# EAGLE schematic EEZ PSU consolidated r5B13a (EAGLE 6.1), part 1 of 2
Assembly variants: Farnell, TME

## Sheet 1 of 12: Power pre-regulator
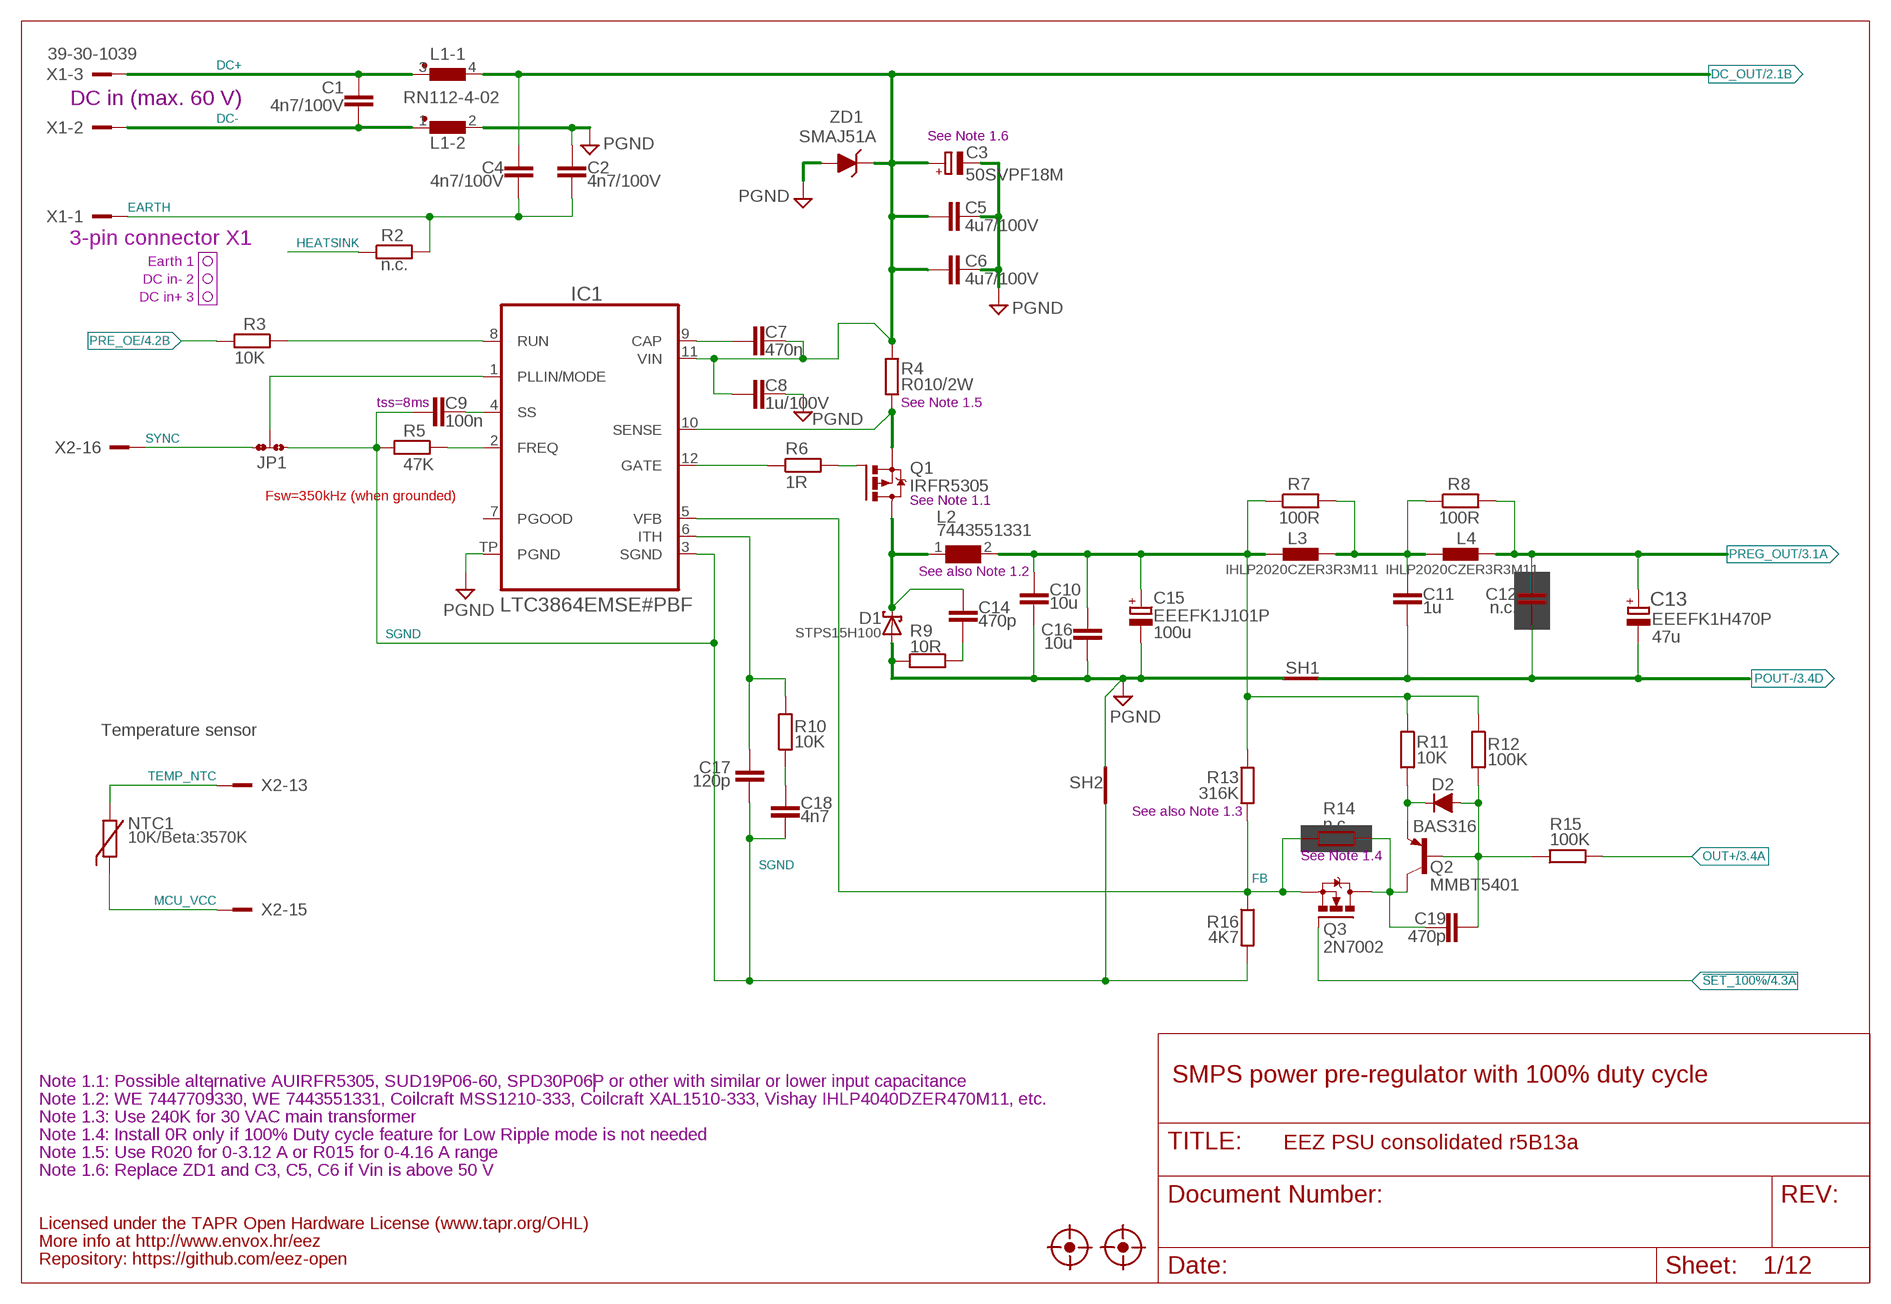
[diagram p0: schematic, sheet 1]

### Parts
C1  4n7/100V  C-EUC1206  [C1206]
C2  4n7/100V  C-EUC1206  [C1206]
C3  50SVPF18M  EEE-FK1J220P-CASE-E  [CAPAE830X650N]
C4  4n7/100V  C-EUC1206  [C1206]
C5  4u7/100V  C-EUC1210  [C1210]
C6  4u7/100V  C-EUC1210  [C1210]
C7  470n  C-EUC0805  [C0805]
C8  1u/100V  C-EUC1206  [C1206]
C9  100n  C-EUC0603  [C0603]
C10  10u  C-EUC1210  [C1210]
C11  1u  C-EUC0805  [C0805]
C12  n.c.  C-EUC0805  [C0805]
C13  EEEFK1H470P  EEE-FK1J470P-CASE-F  [CAPAE830X1050N]
C14  470p  C-EUC0805  [C0805]
C15  EEEFK1J101P  ECAPF  [PANASONIC_F]
C16  10u  C-EUC1210  [C1210]
C17  120p  C-EUC0805  [C0805]
C18  4n7  C-EUC0805  [C0805]
C19  470p  C-EUC0805  [C0805]
D1  STPS15H100  SCHOTTKYTO252  [TO252]
D2  BAS316  DIODESOD323R  [SOD323-R]
FM1  FIDUCIAL_2  [FIDUCIAL_DUAL]
FM2  FIDUCIAL_2  [FIDUCIAL_DUAL]
IC1  LTC3864EMSE#PBF  LTC3864  [LTC_05-08-1666]
JP1  JP3-CUT  [JP3-CUT]
L1  RN112-4-02  RN112  [RN112]
L2  7443551331  WE-HCI-7443551331_1350/1365  [WE-HCI_1350/1365]
L3  IHLP2020CZER3R3M11  IHLP-2020BZ-11  [IHLP-2020BZ-11]
L4  IHLP2020CZER3R3M11  IHLP-2020BZ-11  [IHLP-2020BZ-11]
NTC1  10K/Beta:3570K  NTC0805  [R_0204/5+0805]
Q1  IRFR5305  P-MOSFETDPAK  [TO229P990X239-3N]
Q2  MMBT5401  BC857B-PNP-SOT23-BEC  [SOT23-BEC]
Q3  2N7002  [SOT103P240X110-3N]
R2  n.c.  R-EU_R0805  [R0805]
R3  10K  R-EU_R0805  [R0805]
R4  R010/2W  R-EU_R2512  [R2512]
R5  47K  R-EU_R0805  [R0805]
R6  1R  R-EU_R0805  [R0805]
R7  100R  R-EU_R0805  [R0805]
R8  100R  R-EU_R0805  [R0805]
R9  10R  R-EU_R1206  [R1206]
R10  10K  R-EU_R0805  [R0805]
R11  10K  R-EU_R0805  [R0805]
R12  100K  R-EU_R0805  [R0805]
R13  316K  R-EU_R0805  [R0805]
R14  n.c.  R-EU_R0805  [R0805]
R15  100K  R-EU_R0805  [R0805]
R16  4K7  R-EU_R0805  [R0805]
SH1  Pgnd to Pout- short  SHORTNOHOLE  [SHORT_NOHOLE]
SH2  Sgnd to Pgnd short  SHORTNOHOLE  [SHORT_NOHOLE]
X1  39-30-1039  MINIFIT_39301039  [MINIFIT_39301039]
X2  SSW-113-02-T-D-RA  [SSW-113-02-T-D-RA]
ZD1  SMAJ51A  P6SMB68A  [DO214AA]

### Nets
!SET_100%: Q3.1(G) ; also sheet 4
DC+: C1.2 L1.3 X1.3
DC-: C1.1 L1.1 X1.2
DC_OUT: C3.1 C4.2 C5.1 C6.1 C7.2 C8.1 IC1.11(VIN) L1.4 R4.1 ZD1.C ; also sheet 2,3,12
EARTH: C2.2 C4.1 R2.2 X1.1 ; also sheet 8,10
FB: IC1.5(VFB) Q3.2(S) R13.2 R14.2 R16.1
GND [gnd]: C2.1 C3.2 C5.2 C6.2 C8.2 C10.2 C15.2(-) C16.2 D1.1(A) D1.2(A) IC1.TP(PGND) L1.2 R9.1 SH1.P$2(GND_B) SH2.P$2(GND_B) ZD1.A ; supply symbol labelled PGND ; also sheet 2,3,4,5,6,7,8,9,10,11,12
HEATSINK: R2.1
L_OUT: C10.1 C15.1(+) C16.1 L2.2 L3.1 R7.1 R11.1 R12.1 R13.1
MCU_VCC: NTC1.2 NTC1.2.1 X2.15
MODE: IC1.1(PLLIN/MODE) JP1.COM
N$15: Q1.1(G) R6.2
N$19: D2.C Q2.E R11.2
N$20: C17.1 IC1.6(ITH) R10.2
N$21: C18.1 R10.1
N$23: C7.1 IC1.9(CAP)
N$30: IC1.12(GATE) R6.1
N$31: IC1.2(FREQ) R5.1
N$33: C9.2 IC1.4(SS)
N$34: C19.1 Q2.C Q3.3(D) R14.1
N$35: C11.1 L3.2 L4.1 R7.2 R8.1
N$36: IC1.8(RUN) R3.1
N$38: C14.2 R9.2
N$79: C19.2 D2.A Q2.B R12.2 R15.1
OUT+: R15.2 ; also sheet 3,5
POUT-: C11.2 C12.2 C13.2 SH1.P$1(GND_A) ; also sheet 3
PRE_OE: R3.2 ; also sheet 4
PREG_OUT: C12.1 C13.1 L4.2 R8.2 ; also sheet 3
SENSE: IC1.10(SENSE) Q1.3(S) R4.2
SGND: C9.1 C17.2 C18.2 IC1.3(SGND) JP1.NO R5.2 R16.2 SH2.P$1(GND_A)
SW: C14.1 D1.3(C) L2.1 Q1.2(D)
SYNC: JP1.NC X2.16
TEMP_NTC: NTC1.1 NTC1.1.1 X2.13
Unconnected: IC1.7(PGOOD)

### Notes on the sheet
- DC in (max. 60 V)
- See Note 1.6
- 3-pin connector X1
- Earth 1
- DC in- 2
- DC in+ 3
- tss=8ms | See Note 1.5
- Fsw=350kHz (when grounded)
- See Note 1.1
- See also Note 1.2
- 100u | 47u
- Temperature sensor
- See also Note 1.3
- See Note 1.4
- Note 1.1: Possible alternative AUIRFR5305, SUD19P06-60, SPD30P06P or other with similar or lower input capacitance | SMPS power pre-regulator with 100% duty cycle
- Note 1.2: WE 7447709330, WE 7443551331, Coilcraft MSS1210-333, Coilcraft XAL1510-333, Vishay IHLP4040DZER470M11, etc.
- Note 1.3: Use 240K for 30 VAC main transformer
- Note 1.4: Install 0R only if 100% Duty cycle feature for Low Ripple mode is not needed
- Note 1.5: Use R020 for 0-3.12 A or R015 for 0-4.16 A range
- Note 1.6: Replace ZD1 and C3, C5, C6 if Vin is above 50 V
- Licensed under the TAPR Open Hardware License (www.tapr.org/OHL)
- More info at http://www.envox.hr/eez
- Repository: https://github.com/eez-open

## Sheet 2 of 12: Bias power
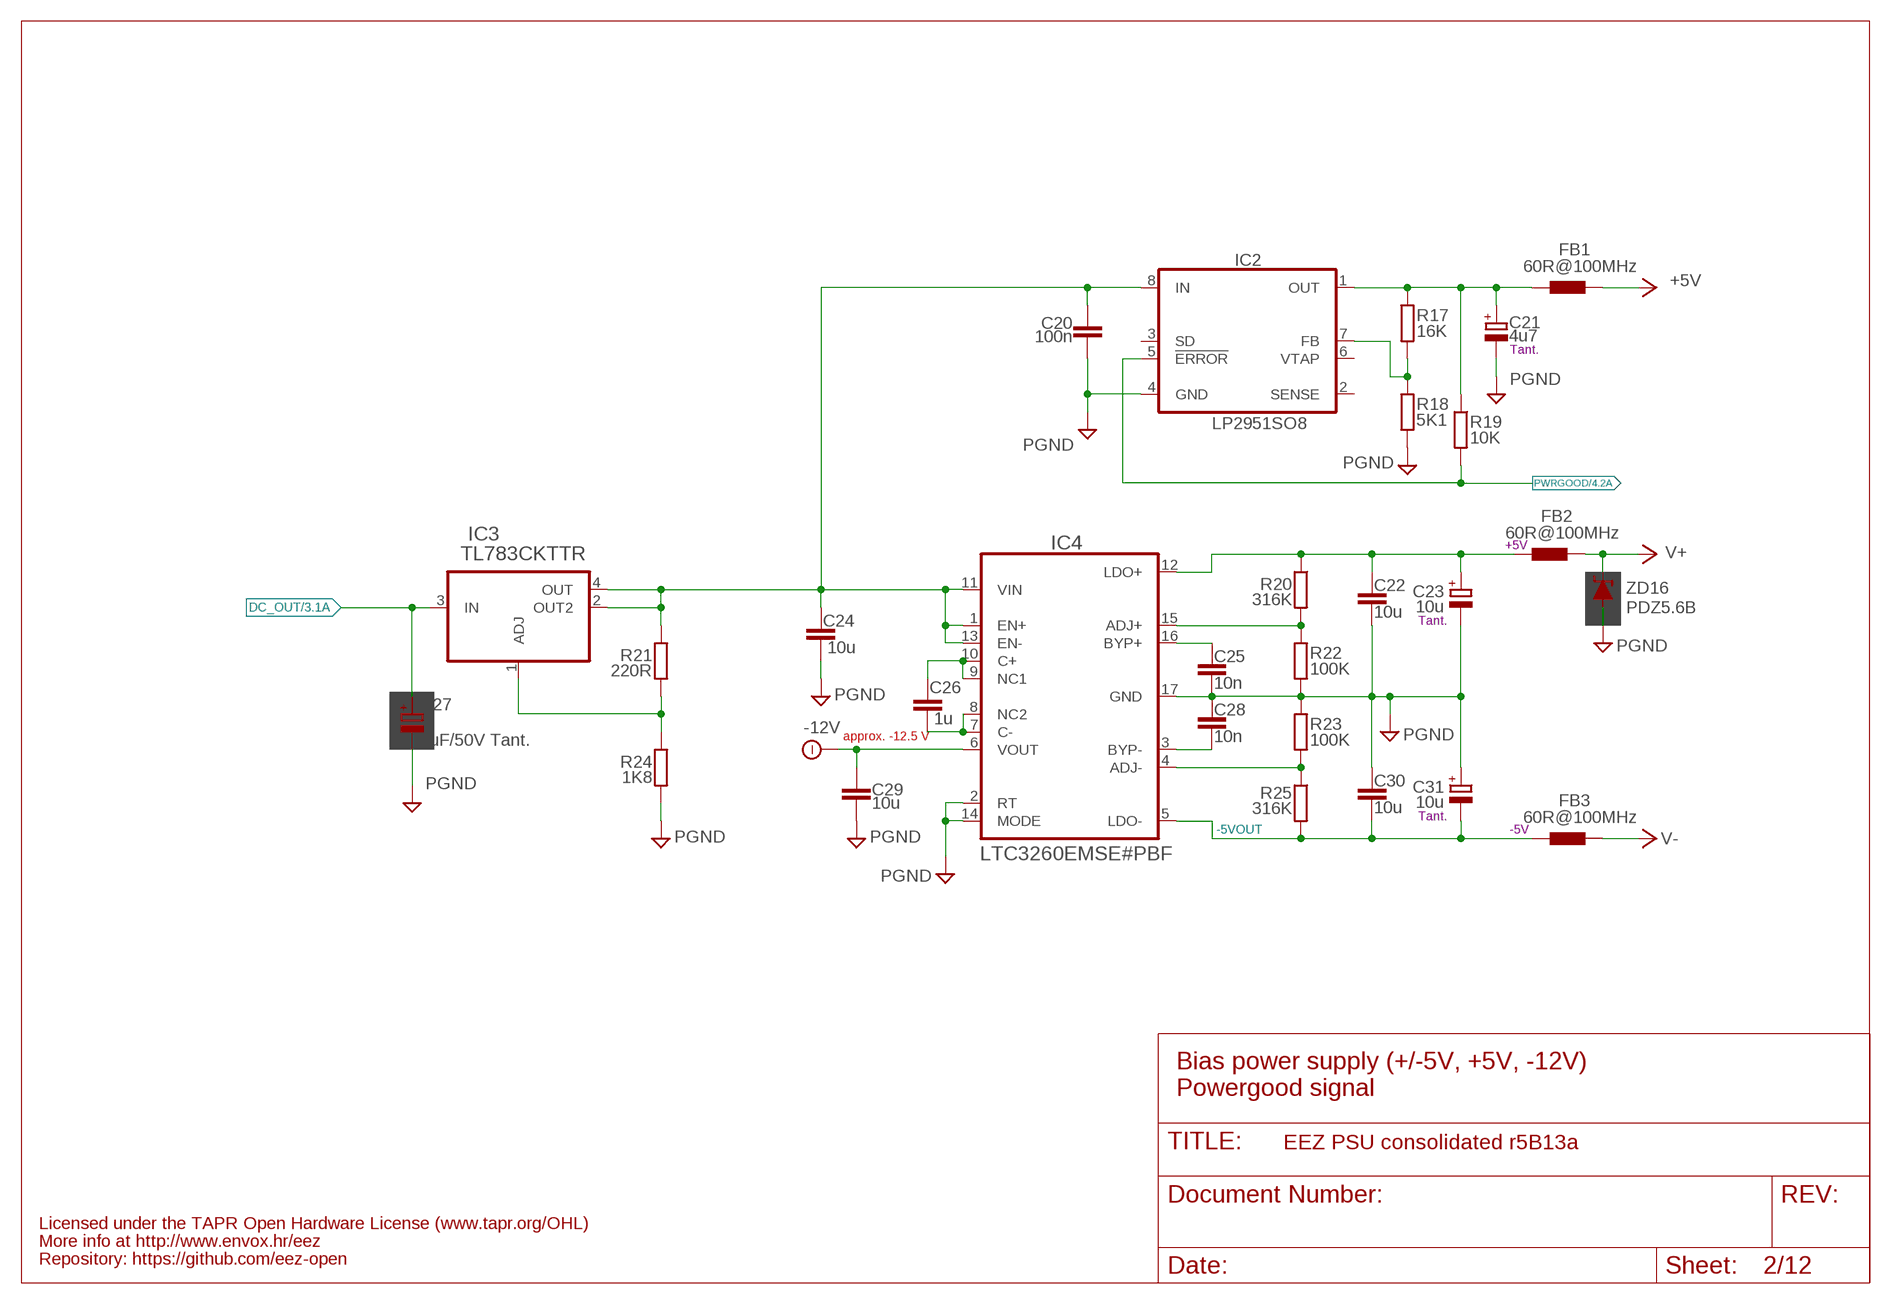
[diagram p1: schematic, sheet 2]

### Parts
C20  100n  C-EUC0603  [C0603]
C21  4u7  ECAP1206  [EC1206]
C22  10u  C-EUC1210  [C1210]  (variant Farnell: 2320829)  (variant TME: CL21B225KAFNNNG )
C23  10u  ECAP1206  [EC1206]
C24  10u  C-EUC1210  [C1210]
C25  10n  C-EUC0805  [C0805]
C26  1u  C-EUC0805  [C0805]
C27  1uF/50V Tant.  CPOL-EUC/6032-28R  [C/6032-28R]
C28  10n  C-EUC0805  [C0805]
C29  10u  C-EUC1210  [C1210]
C30  10u  C-EUC1210  [C1210]
C31  10u  ECAP1206  [EC1206]
FB1  60R@100MHz  FERRITE_BEAD0603  [BEAD0603]
FB2  60R@100MHz  FERRITE_BEAD0603  [BEAD0603]
FB3  60R@100MHz  FERRITE_BEAD0603  [BEAD0603]
IC2  LP2951SO8  [SOIC127P600X175-8N]
IC3  TL783CKTTR  [TO254P1524X483-4N]
IC4  LTC3260EMSE#PBF  LTC3260MSOP16  [SOP50P490X110-17N]
R17  16K  R-EU_R0805  [R0805]
R18  5K1  R-EU_R0805  [R0805]
R19  10K  R-EU_R0805  [R0805]
R20  316K  R-EU_R0805  [R0805]
R21  220R  R-EU_R0805  [R0805]
R22  100K  R-EU_R0805  [R0805]
R23  100K  R-EU_R0805  [R0805]
R24  1K8  R-EU_R0805  [R0805]
R25  316K  R-EU_R0805  [R0805]
ZD16  PDZ5.6B  ZENER-DIODESOD323  [SOD323-W]

### Nets
+5V: FB1.P$2 ; also sheet 3,4,5,6,7,8,9,10,11
+VNR: C20.1 C24.1 IC2.8(IN) IC3.2(OUT2) IC3.4(OUT) IC4.1(EN+) IC4.11(VIN) IC4.13(EN-) R21.1
-5VOUT: C30.2 C31.- FB3.P$1 IC4.5(LDO-) R25.2
-12V: C29.1 IC4.6(VOUT) ; also sheet 3
DC_OUT: C27.+ IC3.3(IN) ; also sheet 1,3,12
GND [gnd]: C20.2 C21.- C22.2 C23.- C24.2 C25.1 C27.- C28.1 C29.2 C30.1 C31.+ IC2.4(GND) IC4.2(RT) IC4.14(MODE) IC4.17(GND) R18.2 R22.2 R23.1 R24.2 ZD16.A ; supply symbol labelled PGND ; also sheet 1,3,4,5,6,7,8,9,10,11,12
N$5: C22.1 C23.+ FB2.P$1 IC4.12(LDO+) R20.1
N$6: C26.1 IC4.9(NC1) IC4.10(C+)
N$7: IC3.1(ADJ) R21.2 R24.1
N$14: IC4.15(ADJ+) R20.2 R22.1
N$43: C26.2 IC4.7(C-) IC4.8(NC2)
N$52: C25.2 IC4.16(BYP+)
N$57: IC4.4(ADJ-) R23.2 R25.1
N$58: C28.2 IC4.3(BYP-)
N$63: IC2.7(FB) R17.2 R18.1
N$167: C21.+ FB1.P$1 IC2.1(OUT) R17.1 R19.1
PWRGOOD: IC2.5(!ERROR) R19.2 ; also sheet 4
V+: FB2.P$2 ZD16.C ; also sheet 3,4,5
V-: FB3.P$2 ; also sheet 3,5
Unconnected: IC2.2(SENSE) IC2.3(SD) IC2.6(VTAP)

### Notes on the sheet
- Tant.
- +5V
- Tant.
- approx. -12.5 V
- Tant.
- -5V
- Bias power supply (+/-5V, +5V, -12V)
- Powergood signal
- Licensed under the TAPR Open Hardware License (www.tapr.org/OHL)
- More info at http://www.envox.hr/eez
- Repository: https://github.com/eez-open

## Sheet 3 of 12: Post-regulator
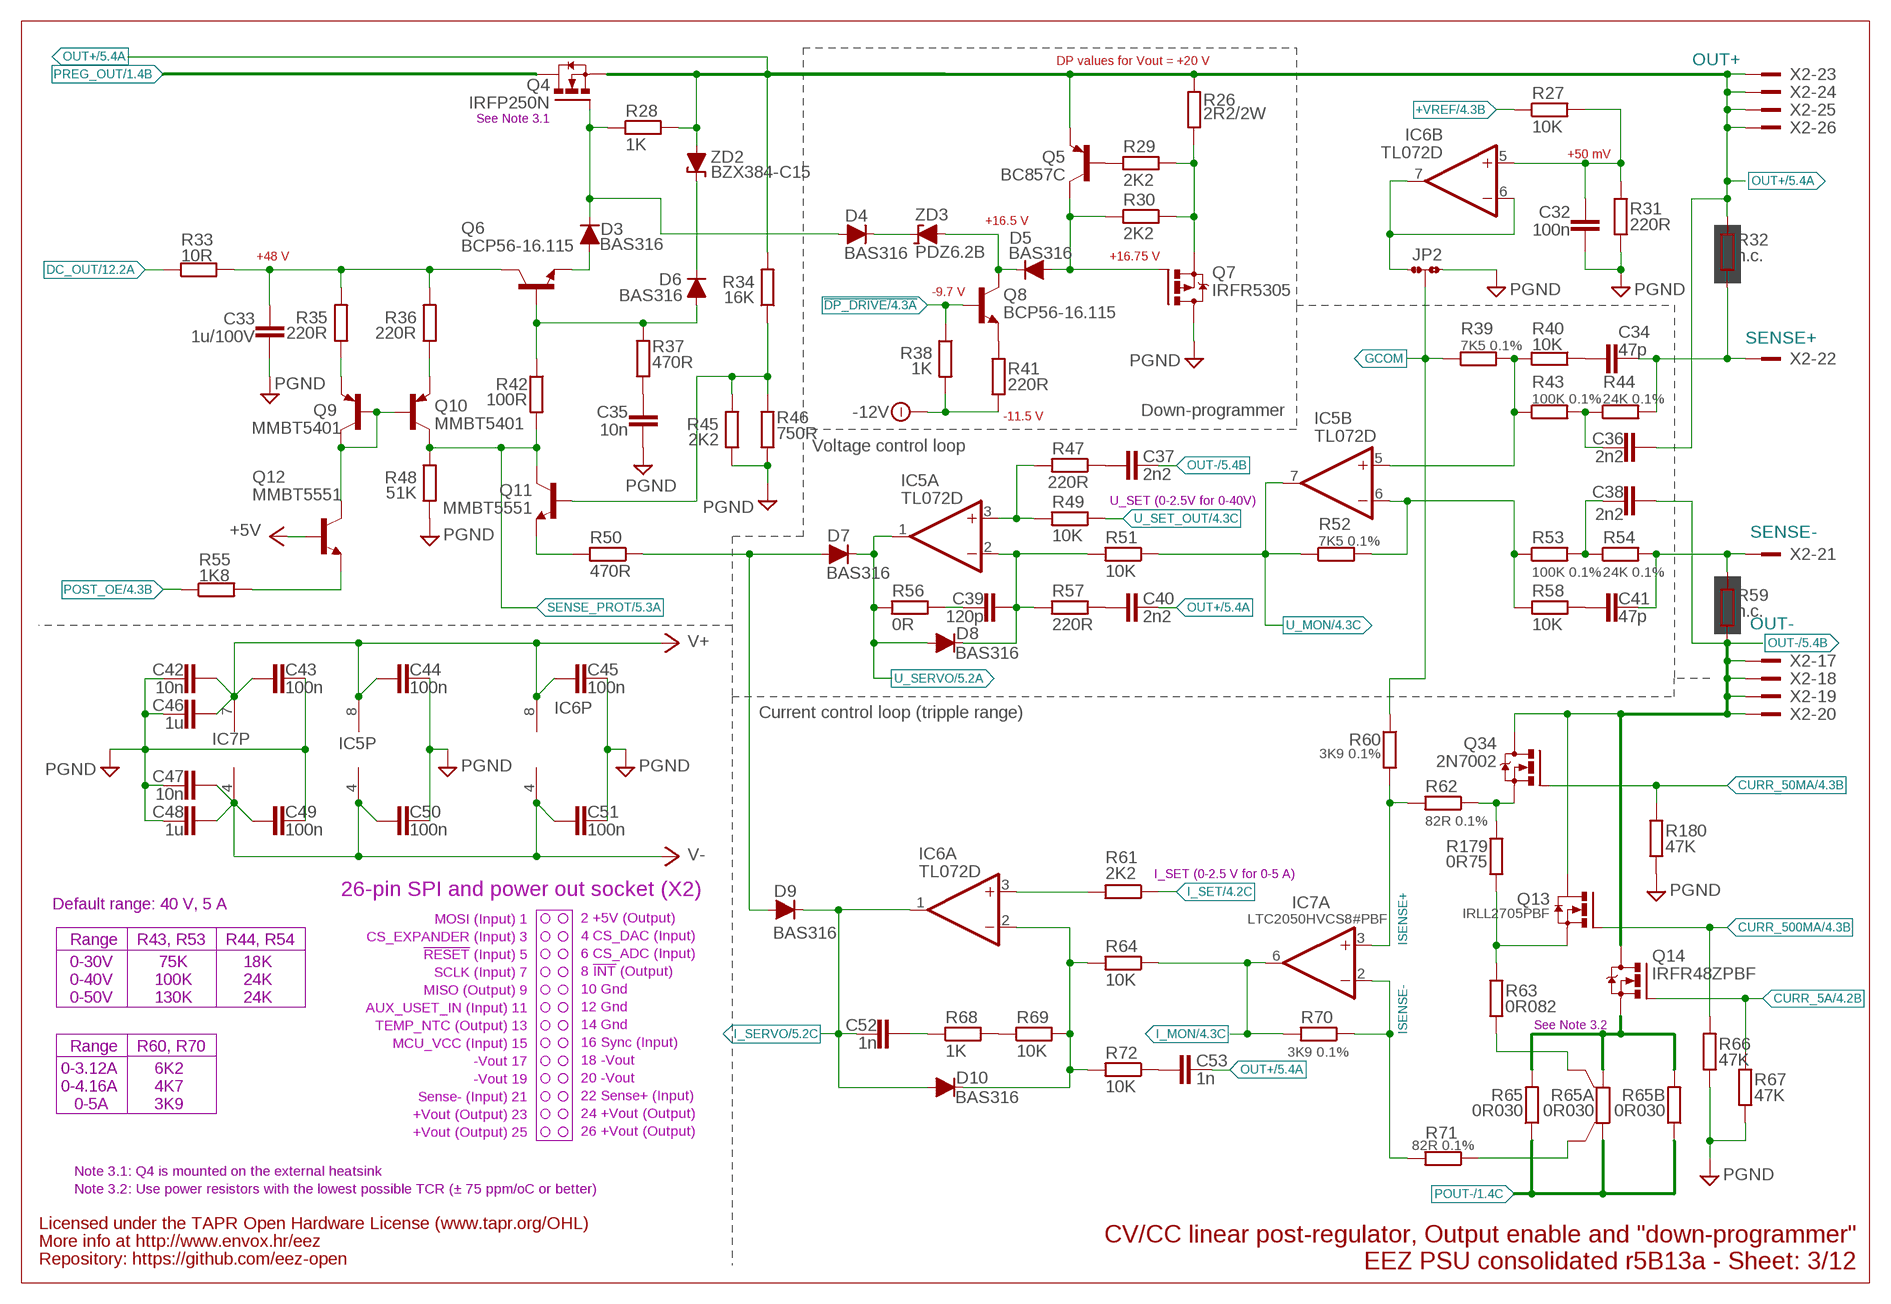
[diagram p2: schematic, sheet 3]

### Parts
C32  100n  C-EUC0603  [C0603]
C33  1u/100V  C-EUC1206  [C1206]
C34  47p  C-EUC0805  [C0805]
C35  10n  C-EUC0805  [C0805]
C36  2n2  C-EUC0805  [C0805]
C37  2n2  C-EUC0805  [C0805]
C38  2n2  C-EUC0805  [C0805]
C39  120p  C-EUC0805  [C0805]
C40  2n2  C-EUC0805  [C0805]
C41  47p  C-EUC0805  [C0805]
C42  10n  C-EUC0805  [C0805]
C43  100n  C-EUC0603  [C0603]
C44  100n  C-EUC0603  [C0603]
C45  100n  C-EUC0603  [C0603]
C46  1u  C-EUC0805  [C0805]
C47  10n  C-EUC0805  [C0805]
C48  1u  C-EUC0805  [C0805]
C49  100n  C-EUC0603  [C0603]
C50  100n  C-EUC0603  [C0603]
C51  100n  C-EUC0603  [C0603]
C52  1n  C-EUC0805  [C0805]
C53  1n  C-EUC0805  [C0805]
D3  BAS316  DIODESOD323R  [SOD323-R]
D4  BAS316  DIODESOD323R  [SOD323-R]
D5  BAS316  DIODESOD323R  [SOD323-R]
D6  BAS316  DIODESOD323R  [SOD323-R]
D7  BAS316  DIODESOD323R  [SOD323-R]
D8  BAS316  DIODESOD323R  [SOD323-R]
D9  BAS316  DIODESOD323R  [SOD323-R]
D10  BAS316  DIODESOD323R  [SOD323-R]
IC5  TL072D  TL072SOIC8  [SOIC127P600X173-8N]
IC6  TL072D  TL072SOIC8  [SOIC127P600X173-8N]
IC7  LTC2050HVCS8#PBF  OP27GSZSO8  [SOIC127P600X173-8N]
JP2  JP3-CUT  [JP3-CUT]
Q4  IRFP250N  IRFP240BOTTOM  [TO247BH-CLR]
Q5  BC857C  BC857C-PNP-SOT23-BEC  [SOT23-BEC]
Q6  BCP56-16.115  BCP56  [SOT230P700X180-4N]
Q7  IRFR5305  P-MOSFETDPAK  [TO229P990X239-3N]
Q8  BCP56-16.115  BCP56  [SOT230P700X180-4N]
Q9  MMBT5401  BC857B-PNP-SOT23-BEC  [SOT23-BEC]
Q10  MMBT5401  BC857B-PNP-SOT23-BEC  [SOT23-BEC]
Q11  MMBT5551  MMBT5551LT1-NPN-SOT23-BEC  [SOT23-BEC]
Q12  MMBT5551  MMBT5551LT1-NPN-SOT23-BEC  [SOT23-BEC]
Q13  IRLL2705PBF  N-HEXFET-2D_SOT232-IRLL014N  [SOT223]
Q14  IRFR48ZPBF  N-MOSFETDPAK  [TO229P990X239-3N]
Q34  2N7002  [SOT103P240X110-3N]
R26  2R2/2W  R-EU_R2512  [R2512]
R27  10K  R-EU_R0805  [R0805]
R28  1K  R-EU_R0805  [R0805]
R29  2K2  R-EU_R0805  [R0805]
R30  2K2  R-EU_R0805  [R0805]
R31  220R  R-EU_R0805  [R0805]
R32  n.c.  R-EU_R0805  [R0805]
R33  10R  R-EU_R1206  [R1206]
R34  16K  R-EU_R0805  [R0805]
R35  220R  R-EU_R0805  [R0805]
R36  220R  R-EU_R0805  [R0805]
R37  470R  R-EU_R0805  [R0805]
R38  1K  R-EU_R0805  [R0805]
R39  7K5 0.1%  R-EU_R0805  [R0805]
R40  10K  R-EU_R0805  [R0805]
R41  220R  R-EU_R0805  [R0805]
R42  100R  R-EU_R0805  [R0805]
R43  100K 0.1%  R-EU_R0805  [R0805]
R44  24K 0.1%  R-EU_R0805  [R0805]
R45  2K2  R-EU_R0805  [R0805]
R46  750R  R-EU_R0805  [R0805]
R47  220R  R-EU_R0805  [R0805]
R48  51K  R-EU_R0805  [R0805]
R49  10K  R-EU_R0805  [R0805]
R50  470R  R-EU_R0805  [R0805]
R51  10K  R-EU_R0805  [R0805]
R52  7K5 0.1%  R-EU_R0805  [R0805]
R53  100K 0.1%  R-EU_R0805  [R0805]
R54  24K 0.1%  R-EU_R0805  [R0805]
R55  1K8  R-EU_R0805  [R0805]
R56  0R  R-EU_R0805  [R0805]
R57  220R  R-EU_R0805  [R0805]
R58  10K  R-EU_R0805  [R0805]
R59  n.c.  R-EU_R0805  [R0805]
R60  3K9 0.1%  R-EU_R0805  [R0805]
R61  2K2  R-EU_R0805  [R0805]
R62  82R 0.1%  R-EU_R0805  [R0805]
R63  0R082  R-EU_R1210  [R1210]
R64  10K  R-EU_R0805  [R0805]
R65  0R030  R-EU_R2512  [R2512]
R65A  0R030  R-EU_4WIRE2512  [R_2512-4WIRE]
R65B  0R030  R-EU_R2512  [R2512]
R66  47K  R-EU_R0805  [R0805]
R67  47K  R-EU_R0805  [R0805]
R68  1K  R-EU_R0805  [R0805]
R69  10K  R-EU_R0805  [R0805]
R70  3K9 0.1%  R-EU_R0805  [R0805]
R71  82R 0.1%  R-EU_R0805  [R0805]
R72  10K  R-EU_R0805  [R0805]
R179  0R75  R-EU_R1206  [R1206]
R180  47K  R-EU_R0805  [R0805]
ZD2  BZX384-C15  ZENER-DIODESOD323  [SOD323-W]
ZD3  PDZ6.2B  ZENER-DIODESOD323  [SOD323-W]

### Nets
!DP_DRIVE: Q8.1(B) R38.1 ; also sheet 4
+5V: Q12.B ; also sheet 2,4,5,6,7,8,9,10,11
+VREF: R27.1 ; also sheet 4
-12V: R38.2 R41.2 ; also sheet 2
CURR_5A: Q14.1(G) R67.2 ; also sheet 4
CURR_50MA: Q34.1(G) R180.2 ; also sheet 4
CURR_500MA: Q13.1(G) R66.2 ; also sheet 4
DC_BIAS: C33.1 Q6.2(C) Q6.4(C) R33.2 R35.2 R36.2
DC_OUT: R33.1 ; also sheet 1,2,12
GCOM [gnd]: JP2.COM R39.1 R60.1
GND [gnd]: C32.2 C33.2 C35.2 C42.1 C43.2 C44.1 C45.1 C46.1 C47.1 C48.1 C49.2 C50.1 C51.1 JP2.NO Q7.2(D) R31.2 R45.1 R46.1 R48.1 R66.1 R67.1 R180.1 ; supply symbol labelled PGND ; also sheet 1,2,4,5,6,7,8,9,10,11,12
I_MON: IC7.6(A:OUT) R64.1 R70.2 ; also sheet 4
I_SERVO: C52.2 D9.C D10.A IC6.1(A:OUT) ; also sheet 5
I_SET: R61.1 ; also sheet 4
ISENSE+: IC7.3(A:+IN) R60.2 R62.2
ISENSE-: IC7.2(A:-IN) R70.1 R71.2
LOOP_CTRL: D7.A D9.A R50.1
N$1: Q8.3(E) R41.1
N$2: Q5.B R29.2
N$3: C34.2 R40.1
N$10: C41.2 R58.1
N$13: C32.1 IC6.5(B:+IN) R27.2 R31.1
N$16: IC6.6(B:-IN) IC6.7(B:OUT) JP2.NC
N$17: C38.1 R53.2 R54.1
N$18: C39.2 R56.1
N$22: C53.2 R72.1
N$26: C37.2 R47.1
N$27: C40.2 R57.1
N$29: IC5.3(A:+IN) R47.2 R49.2
N$32: C39.1 D8.C IC5.2(A:-IN) R51.2 R57.2
N$37: D10.C IC6.2(A:-IN) R64.2 R69.2 R72.2
N$44: Q11.B R34.1 R45.2 R46.2
N$50: IC6.3(A:+IN) R61.2
N$56: D3.C D4.A Q4.G R28.1
N$60: Q34.2(S) R62.1 R179.1
N$62: D3.A Q6.3(E)
N$65: D6.A Q6.1(B) R37.2 R42.1
N$67: C35.1 R37.1
N$70: R63.1 R65A.2S
N$117: C36.1 R43.2 R44.1
N$129: D6.C ZD2.C
N$143: D4.C ZD3.C
N$145: Q11.E R50.2
N$146: Q7.3(S) R26.1 R29.1 R30.1
N$147: D5.A Q5.C Q7.1(G) R30.2
N$150: IC5.5(B:+IN) R39.2 R40.2 R43.1
N$158: IC5.6(B:-IN) R52.2 R53.1 R58.2
N$160: R68.2 R69.1
N$162: C52.1 R68.1
N$169: Q14.3(S) R65.2 R65A.2 R65B.2
N$183: Q10.E R36.1
N$184: Q9.E R35.1
N$186: Q12.E R55.2
N$200: R65A.1S R71.1
N$201: Q13.3(S) R63.2 R179.2
OUT+: C36.2 C40.1 C53.1 Q4.S Q5.E R26.2 R28.2 R32.1 R34.2 X2.23 X2.24 X2.25 X2.26 ZD2.A ; also sheet 1,5
OUT-: C37.1 C38.2 Q13.2(D) Q13.4(D) Q14.2(D) Q34.3(D) R59.2 X2.17 X2.18 X2.19 X2.20 ; also sheet 5
POST_OE: R55.1 ; also sheet 4
POUT-: R65.1 R65A.1 R65B.1 ; also sheet 1
PREG_OUT: Q4.D ; also sheet 1
Q7C: Q9.B Q9.C Q10.B Q12.C
Q9C: D5.C Q8.2(C) Q8.4(C) ZD3.A
SENSE+: C34.1 R32.2 R44.2 X2.22 ; also sheet 5
SENSE-: C41.1 R54.2 R59.1 X2.21 ; also sheet 5
SENSE_PROT: Q10.C Q11.C R42.2 R48.2 ; also sheet 5
U_MON: IC5.7(B:OUT) R51.1 R52.1 ; also sheet 4
U_SERVO: D7.C D8.A IC5.1(A:OUT) R56.2 ; also sheet 5
U_SET_OUT: R49.1 ; also sheet 4
V+: C42.2 C43.1 C44.2 C45.2 C46.2 IC5.8(P:V+) IC6.8(P:V+) IC7.7(P:V+) ; also sheet 2,4,5
V-: C47.2 C48.2 C49.1 C50.2 C51.2 IC5.4(P:V-) IC6.4(P:V-) IC7.4(P:V-) ; also sheet 2,5

### Notes on the sheet
- DP values for Vout = +20 V
- See Note 3.1
- +50 mV
- +16.5 V
- +48 V | +16.75 V
- -9.7 V
- Down-programmer
- -11.5 V
- Voltage control loop
- U_SET (0-2.5V for 0-40V)
- Current control loop (tripple range)
- I_SET (0-2.5 V for 0-5 A)
- 26-pin SPI and power out socket (X2)
- Default range: 40 V, 5 A
- MOSI (Input) 1
- 2 +5V (Output)
- CS_EXPANDER (Input) 3
- 4 CS_DAC (Input)
- Range | R43, R53 | R44, R54
- !RESET! (Input) 5
- 6 CS_ADC (Input)
- 0-30V | 75K | 18K | SCLK (Input) 7
- 8 !INT! (Output)
- 0-40V | 100K | 24K | MISO (Output) 9
- 10 Gnd
- 0-50V | 130K | 24K | AUX_USET_IN (Input) 11
- 12 Gnd
- TEMP_NTC (Output) 13 | See Note 3.2
- 14 Gnd
- MCU_VCC (Input) 15
- 16 Sync (Input)
- Range | R60, R70
- -Vout 17
- 18 -Vout
- 0-3.12A | 6K2 | -Vout 19
- 20 -Vout
- 0-4.16A | 4K7 | Sense- (Input) 21
- 22 Sense+ (Input)
- 0-5A | 3K9 | +Vout (Output) 23
- 24 +Vout (Output)
- +Vout (Output) 25
- 26 +Vout (Output)
- Note 3.1: Q4 is mounted on the external heatsink
- Note 3.2: Use power resistors with the lowest possible TCR (± 75 ppm/oC or better)
- Licensed under the TAPR Open Hardware License (www.tapr.org/OHL)
- More info at http://www.envox.hr/eez | CV/CC linear post-regulator, Output enable and "down-programmer"
- Repository: https://github.com/eez-open | EEZ PSU consolidated r5B13a - Sheet: 3/12

## Sheet 4 of 12: Digital control, voltage reference
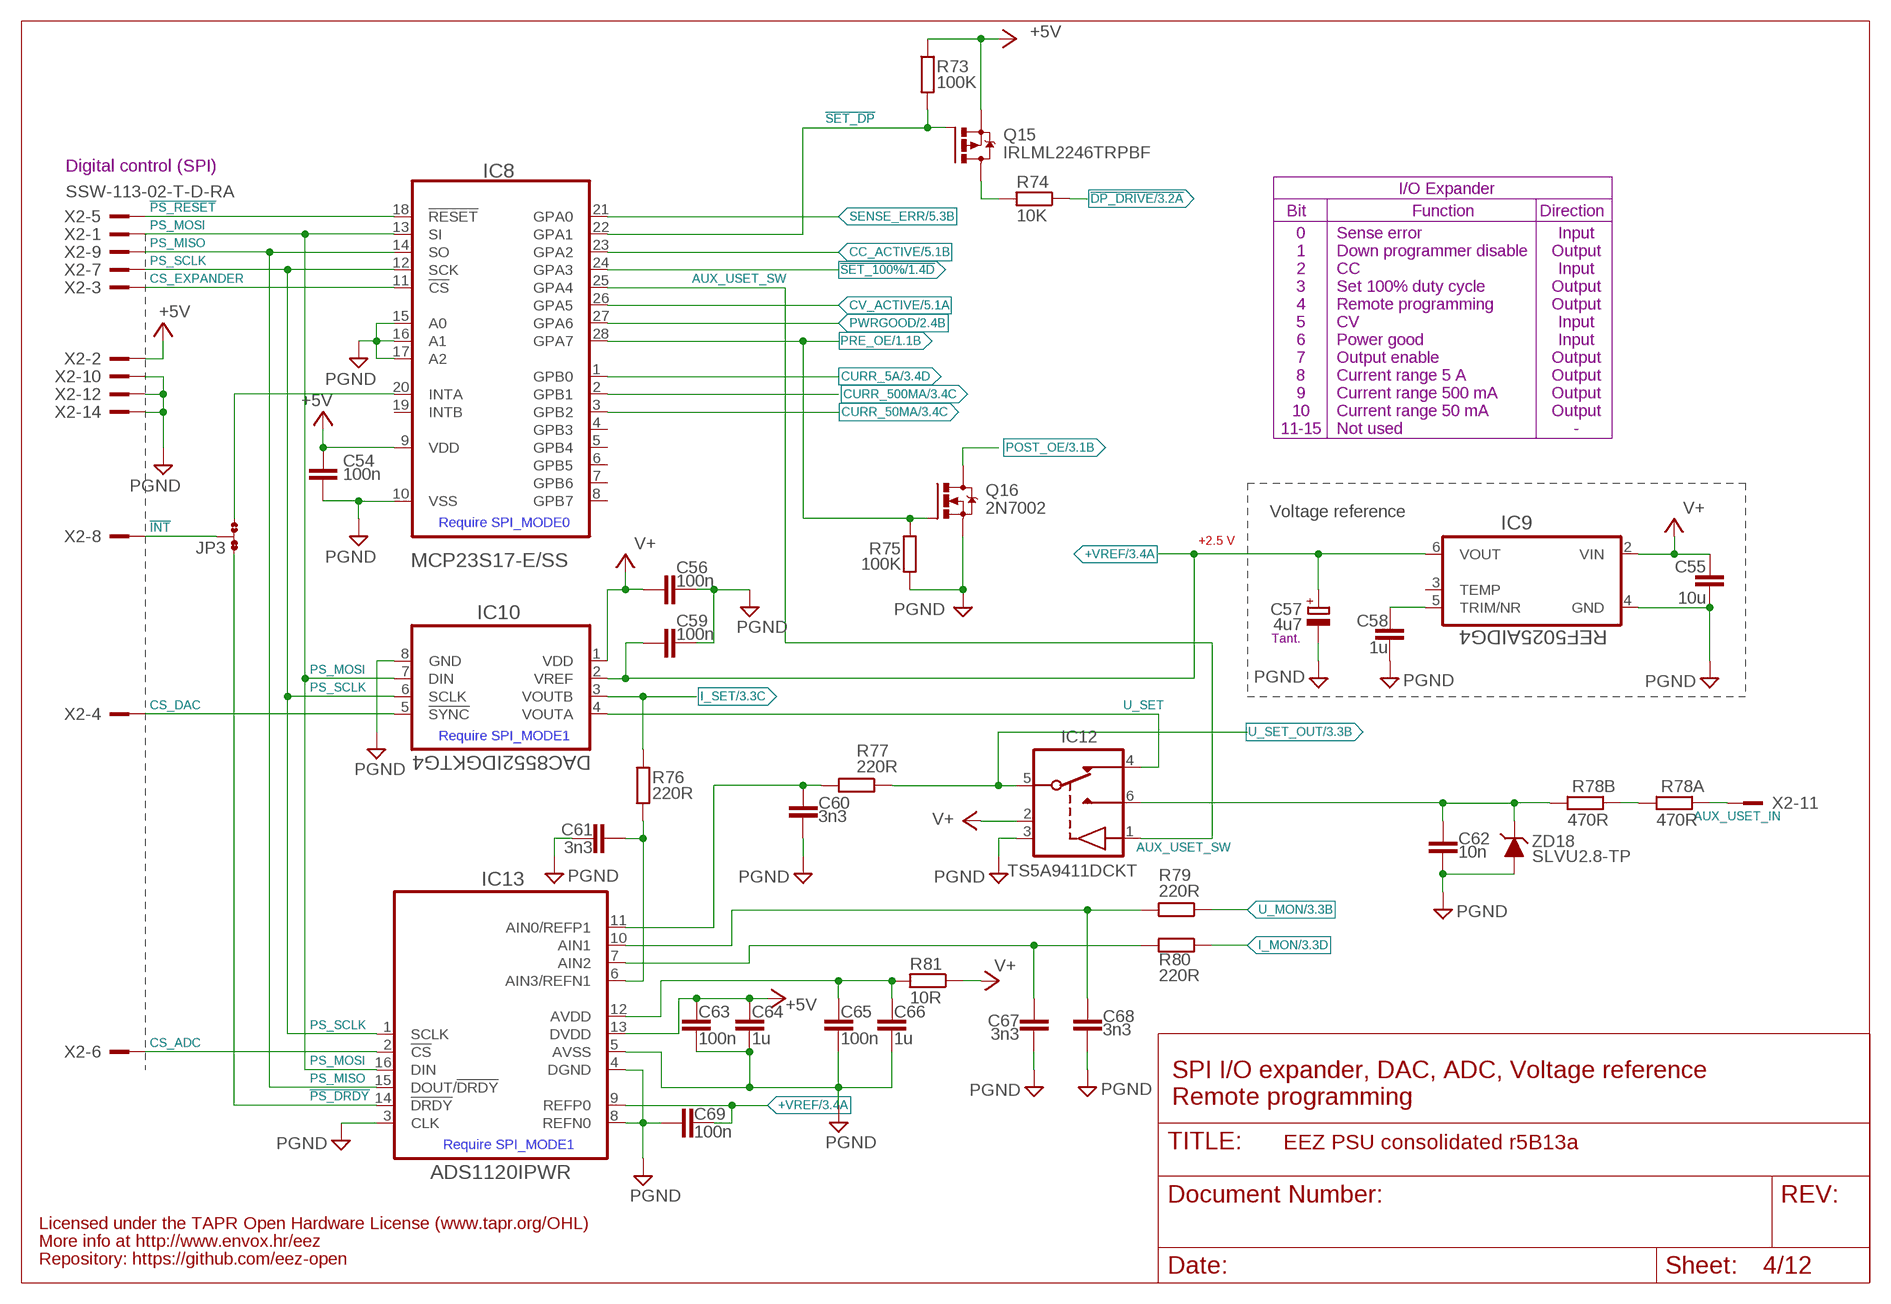
[diagram p3: schematic, sheet 4]

### Parts
C54  100n  C-EUC0603  [C0603]
C55  10u  C-EUC1210  [C1210]
C56  100n  C-EUC0603  [C0603]
C57  4u7  ECAP1206  [EC1206]
C58  1u  C-EUC0805  [C0805]
C59  100n  C-EUC0603  [C0603]
C60  3n3  C-EUC0805  [C0805]
C61  3n3  C-EUC0805  [C0805]
C62  10n  C-EUC0805  [C0805]
C63  100n  C-EUC0603  [C0603]
C64  1u  C-EUC0805  [C0805]
C65  100n  C-EUC0603  [C0603]
C66  1u  C-EUC0805  [C0805]
C67  3n3  C-EUC0805  [C0805]
C68  3n3  C-EUC0805  [C0805]
C69  100n  C-EUC0603  [C0603]
IC8  MCP23S17-E/SS  MCP23S17-E/SSSSOP  [SOP65P780X200-28N]
IC9  REF5025AIDG4  REF50XX  [SOIC127P600X175-8N]
IC10  DAC8552IDGKTG4  DAC8552_DGK_8M  [DGK8-M]
IC12  TS5A9411DCKT  [SOT65P210X110-6N]
IC13  ADS1120IPWR  ADS1120TSSOP-16  [PW(R-PDSO-G16)]
JP3  JP3-CUT  [JP3-CUT]
Q15  IRLML2246TRPBF  [SOT95P237X112-3N]
Q16  2N7002  [SOT103P240X110-3N]
R73  100K  R-EU_R0805  [R0805]
R74  10K  R-EU_R0805  [R0805]
R75  100K  R-EU_R0805  [R0805]
R76  220R  R-EU_R0805  [R0805]
R77  220R  R-EU_R0805  [R0805]
R78A  470R  R-EU_R0805  [R0805]
R78B  470R  R-EU_R0805  [R0805]
R79  220R  R-EU_R0805  [R0805]
R80  220R  R-EU_R0805  [R0805]
R81  10R  R-EU_R1206  [R1206]
ZD18  SLVU2.8-TP  SLVU2.8  [SOT23]

### Nets
!DP_DRIVE: R74.1 ; also sheet 3
!INT: JP3.COM X2.8
!PS_DRDY: IC13.14(!DRDY) JP3.NC
!PS_RESET: IC8.18(!RESET) X2.5
!SET_100%: IC8.24(GPA3) ; also sheet 1
!SET_DP: IC8.22(GPA1) Q15.1(G) R73.2
+5V: C54.1 C63.2 C64.2 IC8.9(VDD) IC13.13(DVDD) Q15.2(S) R73.1 X2.2 ; also sheet 2,3,5,6,7,8,9,10,11
+VREF: C57.+ C59.2 C69.2 IC9.6(VOUT) IC10.2(VREF) IC13.9(REFP0) ; also sheet 3
AUX_USET_IN: R78A.2 X2.11
AUX_USET_SW: IC8.25(GPA4) IC12.1(IN)
CC_ACTIVE: IC8.23(GPA2) ; also sheet 5
CS_ADC: IC13.2(!CS) X2.6
CS_DAC: IC10.5(!SYNC) X2.4
CS_EXPANDER: IC8.11(!CS) X2.3
CURR_5A: IC8.1(GPB0) ; also sheet 3
CURR_50MA: IC8.3(GPB2) ; also sheet 3
CURR_500MA: IC8.2(GPB1) ; also sheet 3
CV_ACTIVE: IC8.26(GPA5) ; also sheet 5
DP_LED: Q15.3(D) R74.2
GND [gnd]: C54.2 C55.2 C56.1 C57.- C58.2 C59.1 C60.1 C61.2 C62.1 C63.1 C64.1 C65.1 C66.1 C67.1 C68.1 C69.1 IC8.10(VSS) IC8.15(A0) IC8.16(A1) IC8.17(A2) IC9.4(GND) IC10.8(GND) IC12.3(GND) IC13.3(CLK) IC13.4(DGND) IC13.5(AVSS) IC13.8(REFN0) Q16.2(S) R75.1 X2.10 X2.12 X2.14 ZD18.1(A) ZD18.2(A) ; supply symbol labelled PGND ; also sheet 1,2,3,5,6,7,8,9,10,11,12
I_MON: R80.1 ; also sheet 3
I_SET: IC10.3(VOUTB) R76.1 ; also sheet 3
INT_EXP: IC8.20(INTA) JP3.NO
N$11: C58.1 IC9.5(TRIM/NR)
N$12: C62.2 IC12.6(S1) R78B.1 ZD18.3(C)
N$28: C68.2 IC13.10(AIN1) R79.2
N$41: C60.2 IC13.11(AIN0/REFP1) R77.2
N$42: C65.2 C66.2 IC13.12(AVDD) R81.2
N$51: C61.1 IC13.6(AIN3/REFN1) R76.2
N$55: C67.2 IC13.7(AIN2) R80.2
N$104: R78A.1 R78B.2
POST_OE: Q16.3(D) ; also sheet 3
PRE_OE: IC8.28(GPA7) Q16.1(G) R75.2 ; also sheet 1
PS_MISO: IC8.14(SO) IC13.15(DOUT/!DRDY) X2.9
PS_MOSI: IC8.13(SI) IC10.7(DIN) IC13.16(DIN) X2.1
PS_SCLK: IC8.12(SCK) IC10.6(SCLK) IC13.1(SCLK) X2.7
PWRGOOD: IC8.27(GPA6) ; also sheet 2
SENSE_ERR: IC8.21(GPA0) ; also sheet 5
U_MON: R79.1 ; also sheet 3
U_SET: IC10.4(VOUTA) IC12.4(S2)
U_SET_OUT: IC12.5(D) R77.1 ; also sheet 3
V+: C55.1 C56.2 IC9.2(VIN) IC10.1(VDD) IC12.2(VDD) R81.1 ; also sheet 2,3,5
Unconnected: IC8.4(GPB3) IC8.5(GPB4) IC8.6(GPB5) IC8.7(GPB6) IC8.8(GPB7) IC8.19(INTB) IC9.3(TEMP)

### Notes on the sheet
- Digital control (SPI)
- I/O Expander
- Bit | Function | Direction
- 0 | Sense error | Input
- 1 | Down programmer disable | Output
- 2 | CC | Input
- 3 | Set 100% duty cycle | Output
- 4 | Remote programming | Output
- 5 | CV | Input
- 6 | Power good | Input
- 7 | Output enable | Output
- 8 | Current range 5 A | Output
- 9 | Current range 500 mA | Output
- 10 | Current range 50 mA | Output
- 11-15 | Not used | -
- Voltage reference
- Require SPI_MODE0
- +2.5 V
- Tant.
- Require SPI_MODE1
- SPI I/O expander, DAC, ADC, Voltage reference
- Remote programming
- Require SPI_MODE1
- Licensed under the TAPR Open Hardware License (www.tapr.org/OHL)
- More info at http://www.envox.hr/eez
- Repository: https://github.com/eez-open

## Sheet 5 of 12: CC/CV, Remote sense protection
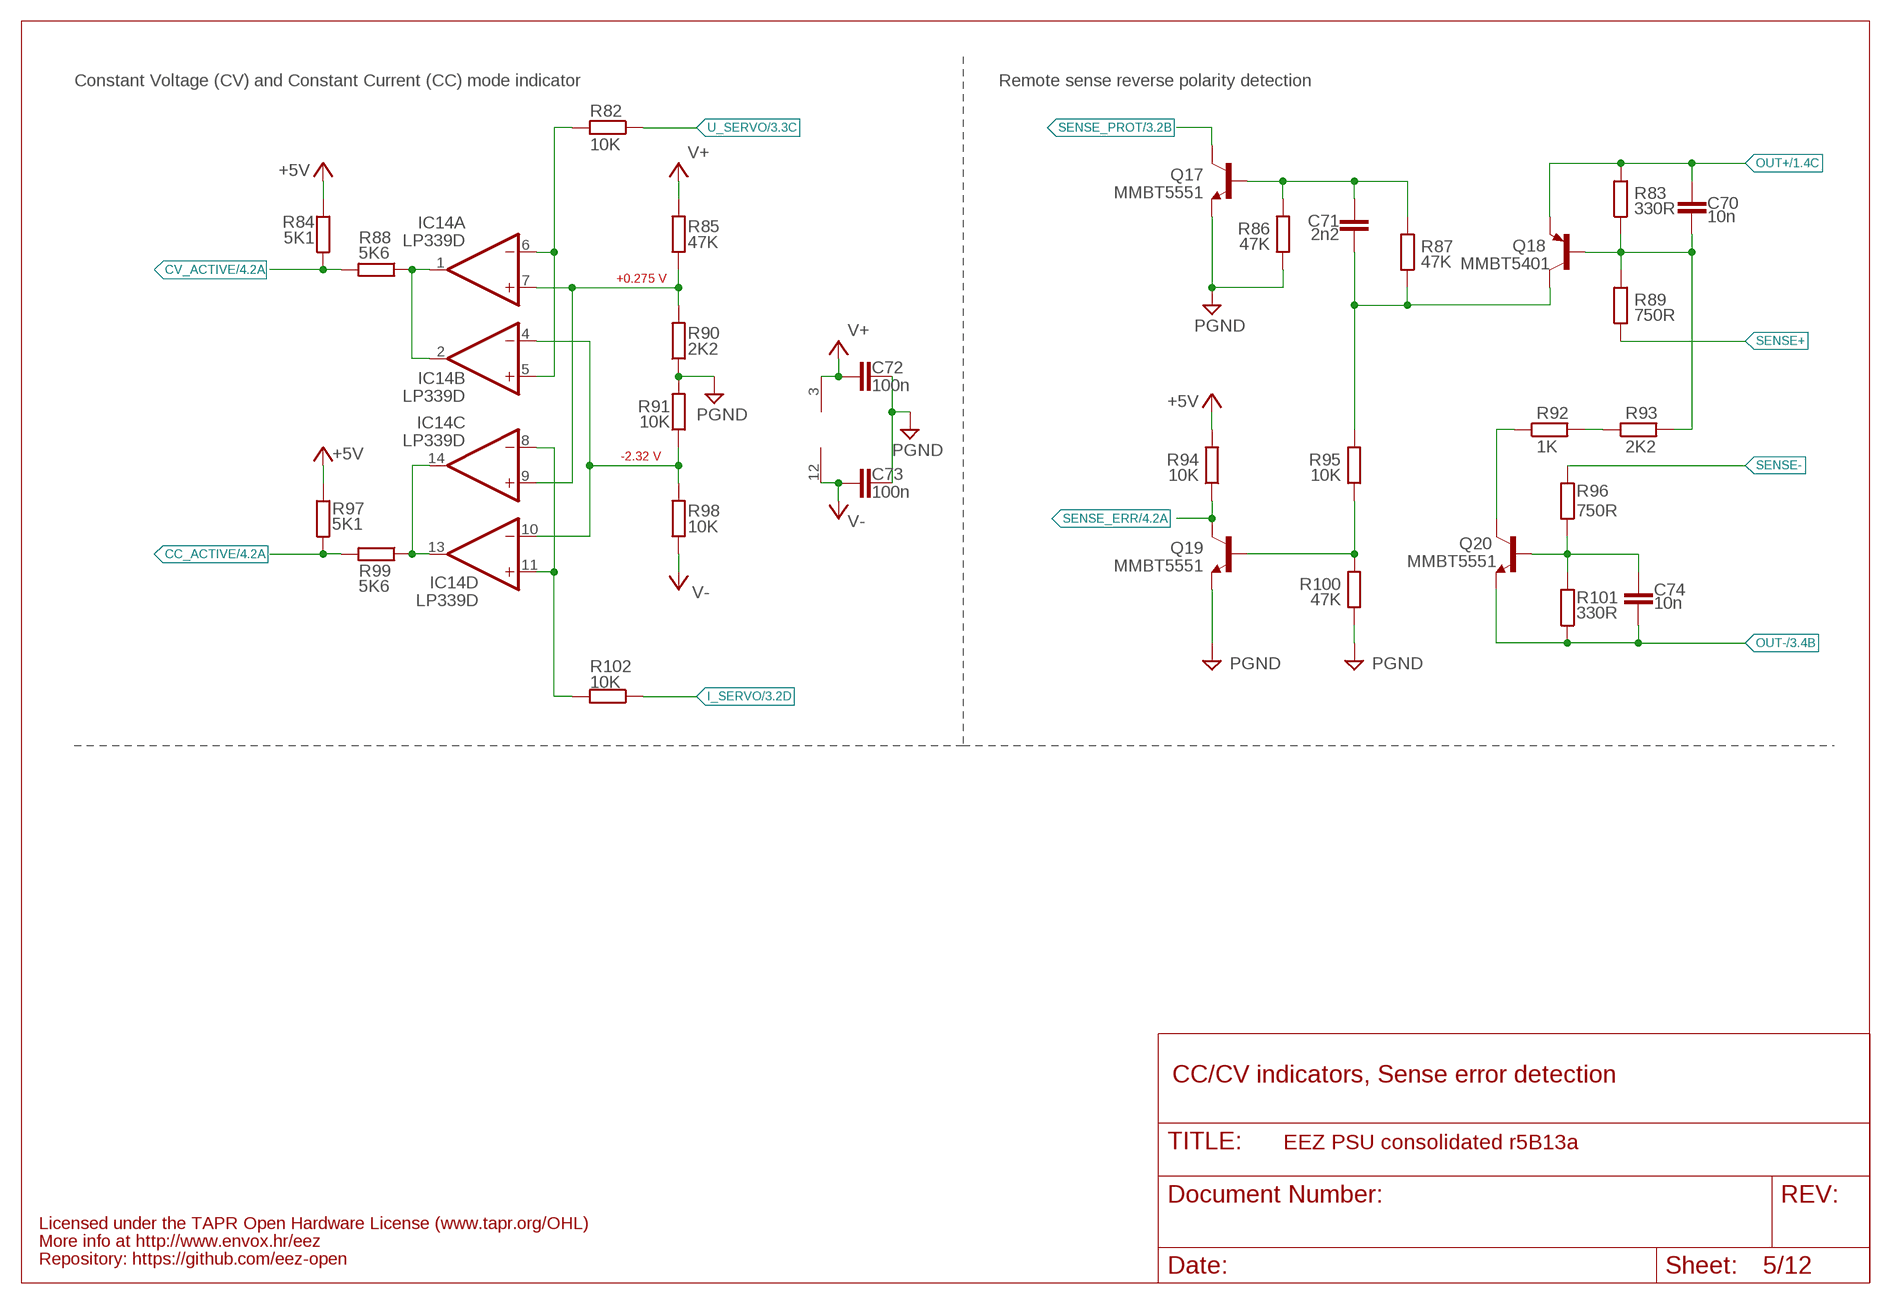
[diagram p4: schematic, sheet 5]

### Parts
C70  10n  C-EUC0805  [C0805]
C71  2n2  C-EUC0805  [C0805]
C72  100n  C-EUC0603  [C0603]
C73  100n  C-EUC0603  [C0603]
C74  10n  C-EUC0805  [C0805]
IC14  LP339D  LM339SO14  [SOIC127P600X175-14N]
Q17  MMBT5551  MMBT5551LT1-NPN-SOT23-BEC  [SOT23-BEC]
Q18  MMBT5401  BC857B-PNP-SOT23-BEC  [SOT23-BEC]
Q19  MMBT5551  MMBT5551LT1-NPN-SOT23-BEC  [SOT23-BEC]
Q20  MMBT5551  MMBT5551LT1-NPN-SOT23-BEC  [SOT23-BEC]
R82  10K  R-EU_R0805  [R0805]
R83  330R  R-EU_R0805  [R0805]
R84  5K1  R-EU_R0805  [R0805]
R85  47K  R-EU_R0805  [R0805]
R86  47K  R-EU_R0805  [R0805]
R87  47K  R-EU_R0805  [R0805]
R88  5K6  R-EU_R0805  [R0805]
R89  750R  R-EU_R0805  [R0805]
R90  2K2  R-EU_R0805  [R0805]
R91  10K  R-EU_R0805  [R0805]
R92  1K  R-EU_R0805  [R0805]
R93  2K2  R-EU_R0805  [R0805]
R94  10K  R-EU_R0805  [R0805]
R95  10K  R-EU_R0805  [R0805]
R96  750R  R-EU_R0805  [R0805]
R97  5K1  R-EU_R0805  [R0805]
R98  10K  R-EU_R0805  [R0805]
R99  5K6  R-EU_R0805  [R0805]
R100  47K  R-EU_R0805  [R0805]
R101  330R  R-EU_R0805  [R0805]
R102  10K  R-EU_R0805  [R0805]

### Nets
+5V: R84.2 R94.2 R97.2 ; also sheet 2,3,4,6,7,8,9,10,11
CC_ACTIVE: R97.1 R99.2 ; also sheet 4
CV_ACTIVE: R84.1 R88.2 ; also sheet 4
GND [gnd]: C72.1 C73.1 Q17.E Q19.E R86.1 R90.1 R91.2 R100.1 ; supply symbol labelled PGND ; also sheet 1,2,3,4,6,7,8,9,10,11,12
I_SERVO: R102.1 ; also sheet 3
N$25: C70.2 Q18.B R83.1 R89.2 R93.2
N$39: Q19.B R95.1 R100.2
N$40: C71.2 Q18.C R87.1 R95.2
N$45: IC14.1(A:OUT) IC14.2(B:OUT) R88.1
N$47: Q20.C R92.1
N$48: IC14.13(D:OUT) IC14.14(C:OUT) R99.1
N$49: C74.1 Q20.B R96.1 R101.2
N$53: C71.1 Q17.B R86.2 R87.2
N$153: IC14.5(B:+IN) IC14.6(A:-IN) R82.2
N$161: IC14.8(C:-IN) IC14.11(D:+IN) R102.2
N$170: IC14.7(A:+IN) IC14.9(C:+IN) R85.1 R90.2
N$173: R92.2 R93.1
N$177: IC14.4(B:-IN) IC14.10(D:-IN) R91.1 R98.2
OUT+: C70.1 Q18.E R83.2 ; also sheet 1,3
OUT-: C74.2 Q20.E R101.1 ; also sheet 3
SENSE+: R89.1 ; also sheet 3
SENSE-: R96.2 ; also sheet 3
SENSE_ERR: Q19.C R94.1 ; also sheet 4
SENSE_PROT: Q17.C ; also sheet 3
U_SERVO: R82.1 ; also sheet 3
V+: C72.2 IC14.3(P:V+) R85.2 ; also sheet 2,3,4
V-: C73.2 IC14.12(P:GND) R98.1 ; also sheet 2,3

### Notes on the sheet
- Constant Voltage (CV) and Constant Current (CC) mode indicator | Remote sense reverse polarity detection
- +0.275 V
- -2.32 V
- CC/CV indicators, Sense error detection
- Licensed under the TAPR Open Hardware License (www.tapr.org/OHL)
- More info at http://www.envox.hr/eez
- Repository: https://github.com/eez-open

## Sheet 6 of 12: AC soft-start, +5V power
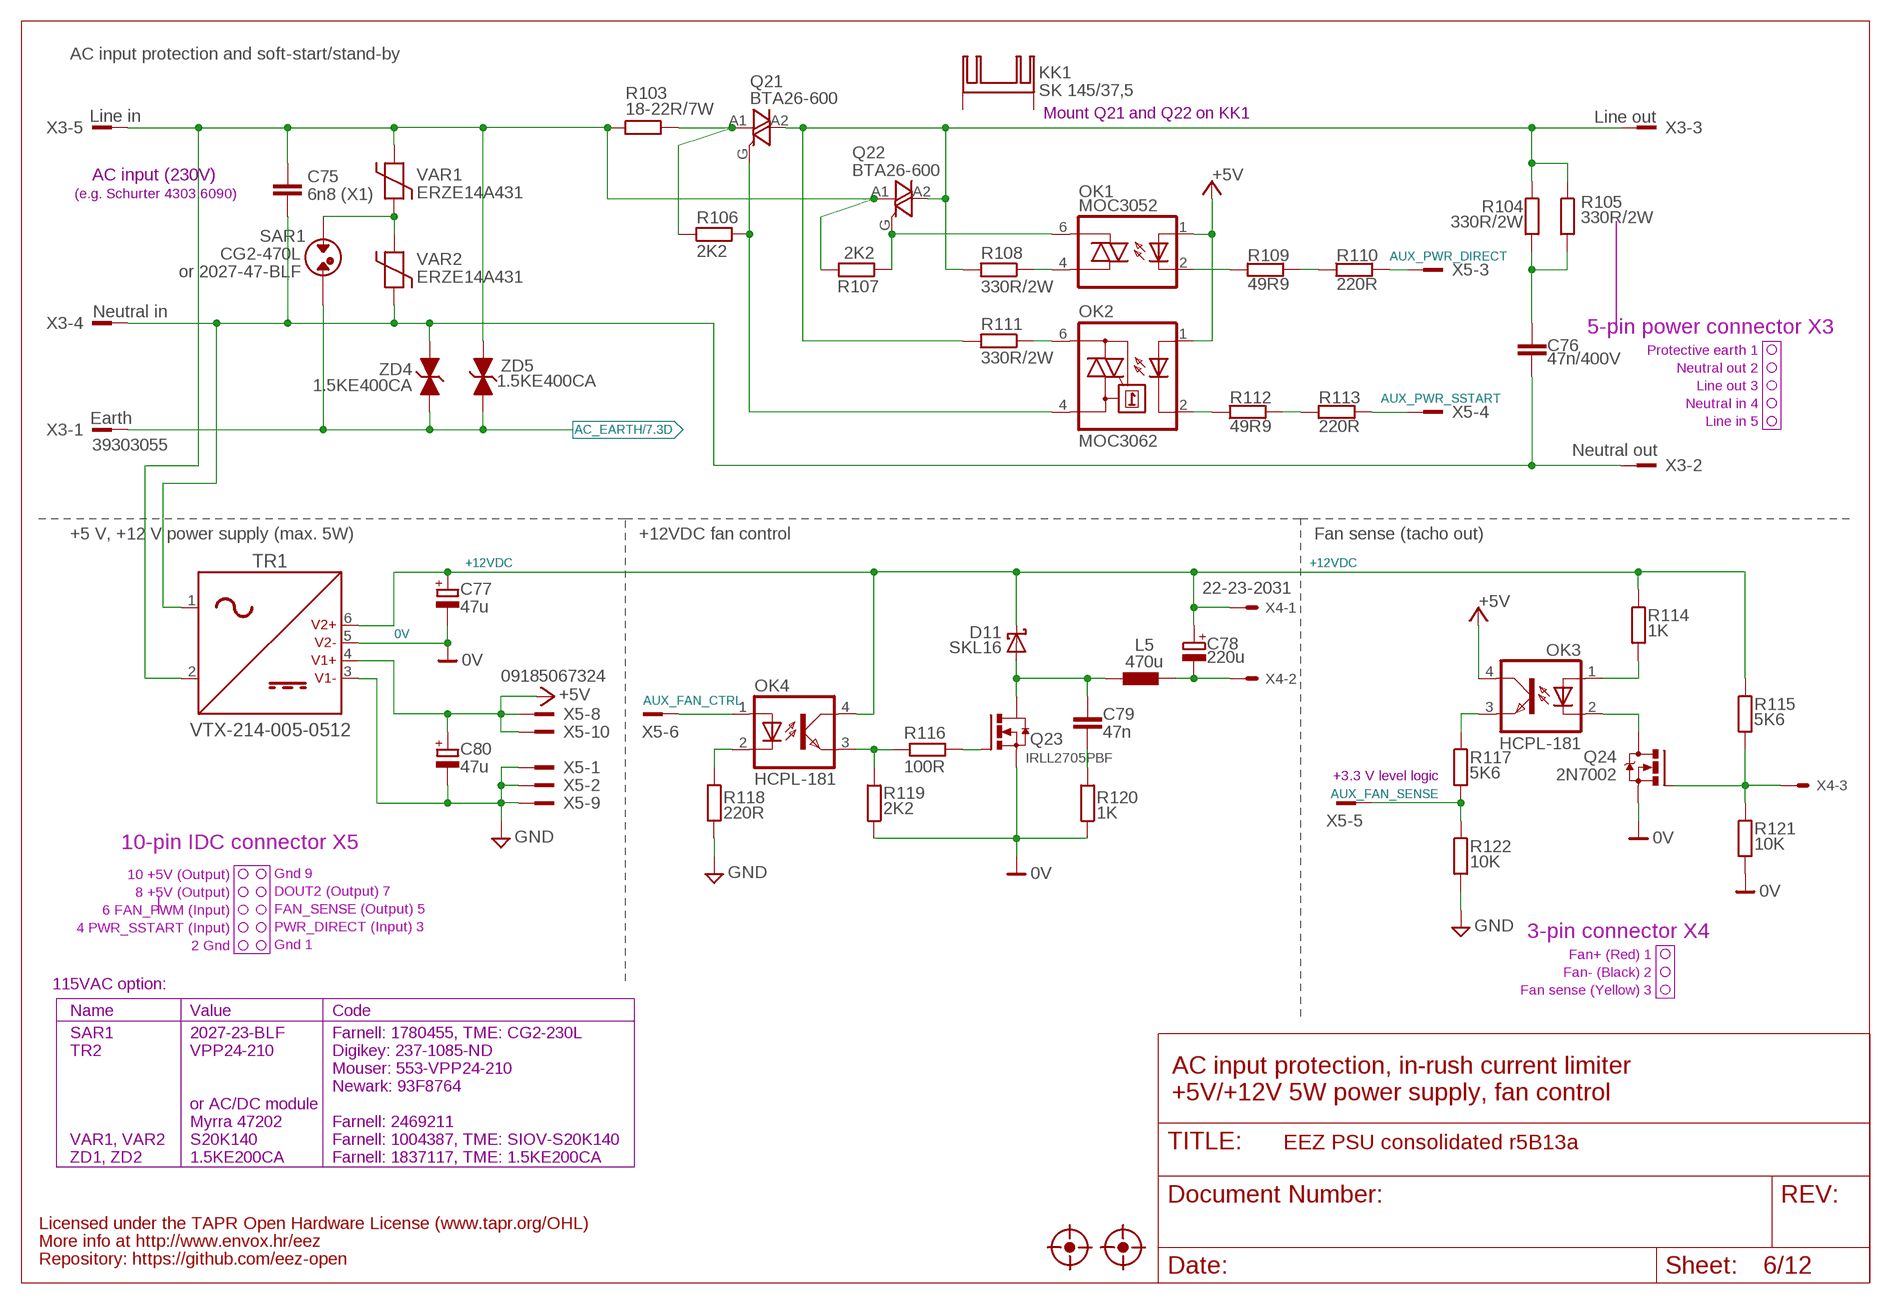
[diagram p5: schematic, sheet 6]

### Parts
C75  6n8 (X1)  C-EU102-064X133  [C102-064X133]
C76  47n/400V  C-EU075-052X106  [C075-052X106]
C77  47u  ECAPPANASONIC_H  [CAPAE660X610N]
C78  220u  ECAPPANASONIC_H  [CAPAE660X610N]
C79  47n  C-EUC0805  [C0805]
C80  47u  ECAPPANASONIC_H  [CAPAE660X610N]
D11  SKL16  SCHOTTKYSOD123  [SOD123]
FM3  FIDUCIAL_2  [FIDUCIAL_DUAL]
FM4  FIDUCIAL_2  [FIDUCIAL_DUAL]
KK1  SK 145/37,5  SK145  [SK145]
L5  470u  DE0704  [DE0704]
OK1  MOC3052  MOC305X  [DIL6-SMD]
OK2  MOC3062  MOC3033S  [DIL6-SMD]
OK3  HCPL-181  [HCPL-181]
OK4  HCPL-181  [HCPL-181]
Q21  BTA26-600  BTA26-V  [TOP3S-1]
Q22  BTA26-600  BTA26-V  [TOP3S-1]
Q23  IRLL2705PBF  N-HEXFET-2D_SOT232-IRLL014N  [SOT223]
Q24  2N7002  [SOT103P240X110-3N]
R103  18-22R/7W  R_EU7W  [R_0913]
R104  330R/2W  R-EU_R2512  [R2512]
R105  330R/2W  R-EU_R2512  [R2512]
R106  2K2  R-EU_R0805  [R0805]
R107  2K2  R-EU_R0805  [R0805]
R108  330R/2W  R-EU_R2512  [R2512]
R109  49R9  R-EU_R0805  [R0805]
R110  220R  R-EU_R0805  [R0805]
R111  330R/2W  R-EU_R2512  [R2512]
R112  49R9  R-EU_R0805  [R0805]
R113  220R  R-EU_R0805  [R0805]
R114  1K  R-EU_R0805  [R0805]
R115  5K6  R-EU_R0805  [R0805]
R116  100R  R-EU_R0805  [R0805]
R117  5K6  R-EU_R0805  [R0805]
R118  220R  R-EU_R0805  [R0805]
R119  2K2  R-EU_R0805  [R0805]
R120  1K  R-EU_R0805  [R0805]
R121  10K  R-EU_R0805  [R0805]
R122  10K  R-EU_R0805  [R0805]
SAR1  CG2-470L  SAR  [SAR]
TR1  VTX-214-005-0512  AC_DC_ADAPTER_DUAL  [PCB_ACDC_VTX_5W_DUAL]
VAR1  ERZE14A431  VARISTOR  [VARISTOR]
VAR2  ERZE14A431  VARISTOR  [VARISTOR]
X3  39303055  MINIFIT_6659-5  [MINIFIT_6659-5]
X4  22-23-2031  [22-23-2031]
X5  09185067324  IDC-10PINBLACK  [IDC-10PIN]
ZD4  1.5KE400CA  1.5KE-BIDIR  [DO201-BIDIR]
ZD5  1.5KE400CA  1.5KE-BIDIR  [DO201-BIDIR]

### Nets
0V: C77.2(-) Q23.3(S) Q24.2(S) R119.1 R120.1 R121.2 TR1.5(V2-)
+5V: C80.1(+) OK1.1(A) OK2.1(A) OK3.4(COL) TR1.4(V1+) X5.8 X5.10 ; also sheet 2,3,4,5,7,8,9,10,11
+12VDC: C77.1(+) C78.1(+) D11.C OK4.4(COL) R114.1 R115.1 TR1.6(V2+) X4.1
AC_EARTH: SAR1.P$2 X3.1 ZD4.C ZD5.C ; also sheet 7
AC_IN_L: C75.1 Q22.A1 R103.1 R107.2 TR1.2(IN2) VAR1.P$2 X3.5 ZD5.A
AC_NEUTRAL: C75.2 C76.1 TR1.1(IN1) VAR2.P$1 X3.2 X3.4 ZD4.A
AC_OUT_L: Q21.A2 Q22.A2 R104.1 R105.1 R108.2 R111.2 X3.3
AUX_FAN_CTRL: OK4.1(A) X5.6
AUX_FAN_SENSE: R117.2 R122.1 X5.5
AUX_PWR_DIRECT: R110.2 X5.3
AUX_PWR_SSTART: R113.2 X5.4
FAN_OUT: C79.2 D11.A L5.2 Q23.2(D) Q23.4(D)
GND [gnd]: C80.2(-) R118.2 R122.2 TR1.3(V1-) X5.1 X5.2 X5.9 ; also sheet 1,2,3,4,5,7,8,9,10,11,12
N$61 [gnd]: OK3.3(EMIT) R117.1
N$66: Q24.1(G) R115.2 R121.1 X4.3
N$71: OK1.6(A2) Q22.G R107.1
N$72: OK2.4(A1) Q21.G R106.2
N$73: OK2.6(A2) R111.1
N$74: R109.2 R110.1
N$75: R112.2 R113.1
N$76: OK1.4(A1) R108.1
N$81: OK4.2(C) R118.1
N$83: C76.2 R104.2 R105.2
N$84: C79.1 R120.2
N$85: Q23.1(G) R116.1
N$86: C78.2(-) L5.1 X4.2
N$114: SAR1.P$1 VAR1.P$1 VAR2.P$2
N$152: Q21.A1 R103.2 R106.1
N$163: OK3.1(A) R114.2
N$165: OK4.3(EMIT) R116.2 R119.2
N$174: OK2.2(C) R112.1
N$175: OK1.2(C) R109.1
N$208: OK3.2(C) Q24.3(D)
Unconnected: KK1.1(K) KK1.2(K)

### Notes on the sheet
- AC input protection and soft-start/stand-by
- Line in
- Mount Q21 and Q22 on KK1 | Line out
- AC input (230V)
- (e.g. Schurter 4303.6090)
- or 2027-47-BLF
- Neutral in
- 5-pin power connector X3
- Protective earth 1
- Neutral out 2
- Line out 3
- Neutral in 4
- Earth
- Line in 5
- Neutral out
- +5 V, +12 V power supply (max. 5W) | +12VDC fan control | Fan sense (tacho out)
- +3.3 V level logic
- 10-pin IDC connector X5
- 10 +5V (Output)
- Gnd 9
- 8 +5V (Output)
- DOUT2 (Output) 7
- 6 FAN_PWM (Input)
- FAN_SENSE (Output) 5
- 4 PWR_SSTART (Input) | 3-pin connector X4
- PWR_DIRECT (Input) 3
- 2 Gnd
- Gnd 1 | Fan+ (Red) 1
- Fan- (Black) 2
- Fan sense (Yellow) 3
- 115VAC option:
- Name | Value | Code
- SAR1 | 2027-23-BLF | Farnell: 1780455, TME: CG2-230L
- TR2 | VPP24-210 | Digikey: 237-1085-ND
- Mouser: 553-VPP24-210 | AC input protection, in-rush current limiter
- Newark: 93F8764
- +5V/+12V 5W power supply, fan control
- or AC/DC module
- Myrra 47202 | Farnell: 2469211
- VAR1, VAR2 | S20K140 | Farnell: 1004387, TME: SIOV-S20K140
- ZD1, ZD2 | 1.5KE200CA | Farnell: 1837117, TME: 1.5KE200CA
- Licensed under the TAPR Open Hardware License (www.tapr.org/OHL)
- More info at http://www.envox.hr/eez
- Repository: https://github.com/eez-open

## Sheet 7 of 12: Ethernet, USB, Fan
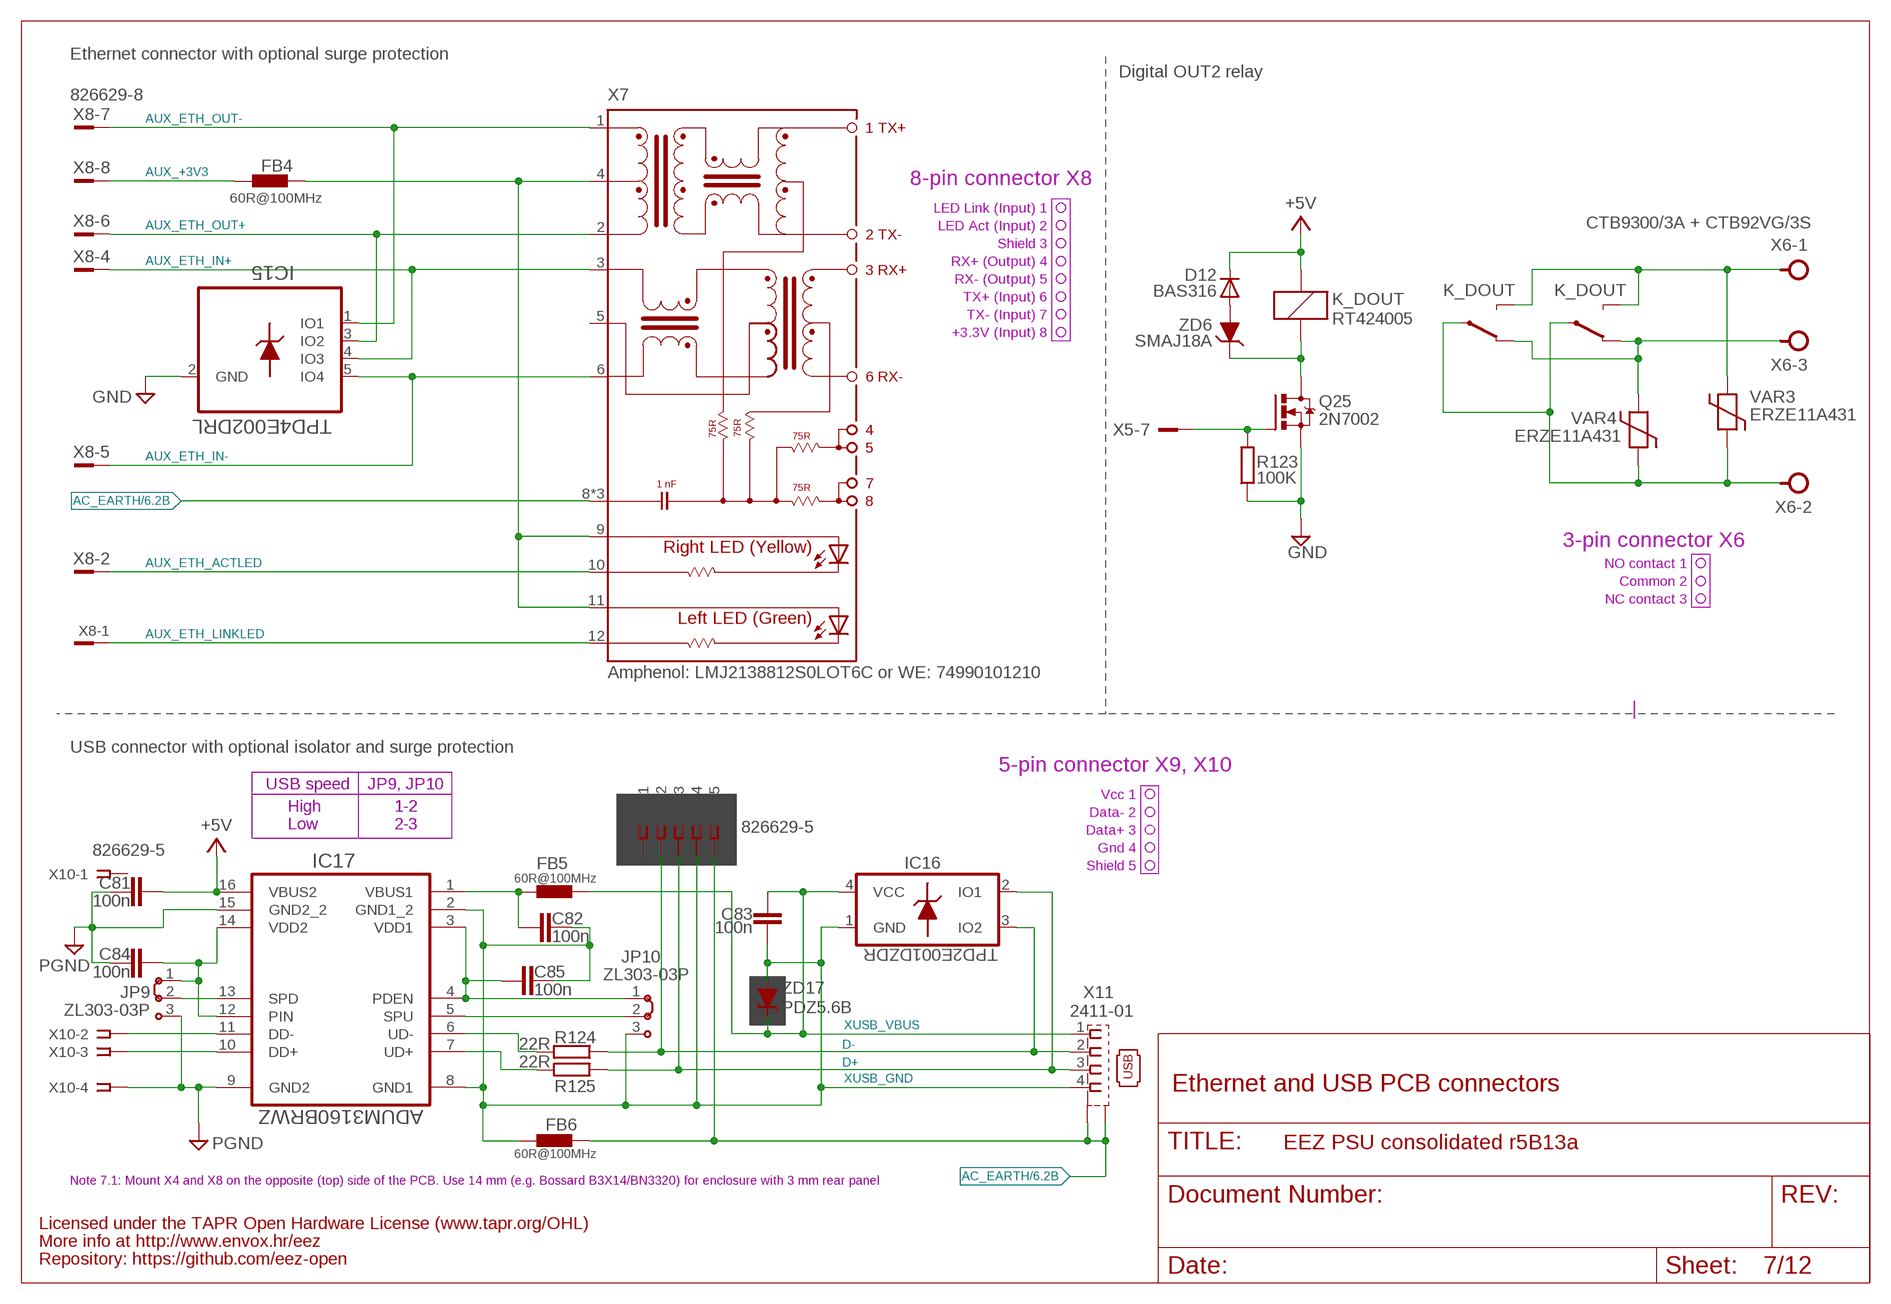
[diagram p6: schematic, sheet 7]

### Parts
C81  100n  C-EUC0603  [C0603]
C82  100n  C-EUC0603  [C0603]
C83  100n  C-EUC0603  [C0603]
C84  100n  C-EUC0603  [C0603]
C85  100n  C-EUC0603  [C0603]
D12  BAS316  DIODE-SOD323-W  [SOD323-W]
FB4  60R@100MHz  FERRITE_BEAD0603  [BEAD0603]
FB5  60R@100MHz  FERRITE_BEAD0603  [BEAD0603]
FB6  60R@100MHz  FERRITE_BEAD0603  [BEAD0603]
IC15  TPD4E002DRL  [DRL5]
IC16  TPD2E001DZDR  [SOP192P292X122-4N]
IC17  ADUM3160BRWZ  ADUM3160BRWZWIDE  [SOIC-16W]
JP9  ZL303-03P  JUMPER-3PIN2MM  [ZL303-03P]
JP10  ZL303-03P  JUMPER-3PIN2MM  [ZL303-03P]
K_DOUT  RT424005  RELAY_RT314012-2  [RT-C/016A5_ROUND]
Q25  2N7002  [SOT103P240X110-3N]
R123  100K  R-EU_R0805  [R0805]
R124  22R  R-EU_R0805  [R0805]
R125  22R  R-EU_R0805  [R0805]
VAR3  ERZE11A431  VARISTOR-13  [VARISTOR_13MM]
VAR4  ERZE11A431  VARISTOR-13  [VARISTOR_13MM]
X6  CTB9300/3A + CTB92VG/3S  TBLOCK5.0_3A-3117  [WR-TBL_3-PIN]
X7  Amphenol: LMJ2138812S0LOT6C or WE: 74990101210  RJ45-VERT  [RJ45-VERT]
X8  826629-8  HEADER_8-PIN  [HEADER_8-PIN]
X9  826629-5  SSW-105-02-S-S  [SSW-105-02-S-S]
X10  826629-5  SSW-105-02-S-S  [SSW-105-02-S-S]
X11  2411-01  KUSBVX-BS1N  [KUSBVX-BS1N]
ZD6  SMAJ18A  PSMAXX  [DO214AC]
ZD17  PDZ5.6B  ZENER-DIODESOD323  [SOD323-W]

### Nets
+5V: C81.1 D12.C IC17.16(VBUS2) K_DOUT.A1(K:C2) ; also sheet 2,3,4,5,6,8,9,10,11
AC_EARTH: FB6.P$1 X7.8(SH) X7.SH1(SH) X7.SH2(SH) X9.5 X11.M1(S1) X11.M2(S2) ; also sheet 6
AUX_+3V3: FB4.P$2 X8.8
AUX_ETH_ACTLED: X7.10(YELLOW-C) X8.2
AUX_ETH_IN+: IC15.4(IO3) X7.3(RD+) X8.4
AUX_ETH_IN-: IC15.5(IO4) X7.6(RD-) X8.5
AUX_ETH_LINKLED: X7.12(GREEN-C) X8.1
AUX_ETH_OUT+: IC15.3(IO2) X7.2(TD-) X8.6
AUX_ETH_OUT-: IC15.1(IO1) X7.1(TD+) X8.7
D+: IC16.2(IO1) R125.1 X9.3 X11.3
D-: IC16.3(IO2) R124.1 X9.2 X11.2
GND [gnd]: C81.2 C84.2 IC15.2(GND) IC17.9(GND2) IC17.15(GND2_2) JP9.3 Q25.2(S) R123.1 X10.4 ; supply symbol labelled PGND ; also sheet 1,2,3,4,5,6,8,9,10,11,12
MCU_D+: IC17.10(DD+) X10.3
MCU_D-: IC17.11(DD-) X10.2
N$24: FB4.P$1 X7.4(CT) X7.9(YELLOW_A) X7.11(GREEN-A)
N$54: IC17.13(SPD) JP9.2
N$64: K_DOUT.14A(-1:O) K_DOUT.14B(-2:O) VAR3.2 X6.1
N$68: K_DOUT.11A(-1:P) K_DOUT.11B(-2:P) VAR3.1 VAR4.1 X6.2
N$69: Q25.1(G) R123.2 X5.7
N$77: D12.A ZD6.A
N$80: K_DOUT.A2(K:C1) Q25.3(D) ZD6.C
N$87: C85.1 IC17.3(VDD1) IC17.4(PDEN) JP10.1
N$88: IC17.6(UD-) R124.2
N$89: IC17.7(UD+) R125.2
N$90: C82.1 FB5.P$2 IC17.1(VBUS1)
N$91: C84.1 IC17.12(PIN) IC17.14(VDD2) JP9.1
N$125: IC17.5(SPU) JP10.2
N$207: K_DOUT.12A(-1:S) K_DOUT.12B(-2:S) VAR4.2 X6.3
XUSB_GND: C82.2 C83.1 C85.2 FB6.P$2 IC16.1(GND) IC17.2(GND1_2) IC17.8(GND1) JP10.3 X9.4 X11.4 ZD17.A
XUSB_VBUS: C83.2 FB5.P$1 IC16.4(VCC) X11.1 ZD17.C
Unconnected: X7.5(CR) X8.3 X9.1 X10.1 X10.5

### Notes on the sheet
- Ethernet connector with optional surge protection
- Digital OUT2 relay
- 8-pin connector X8
- LED Link (Input) 1
- LED Act (Input) 2
- Shield 3
- RX+ (Output) 4
- RX- (Output) 5
- TX+ (Input) 6
- TX- (Input) 7
- +3.3V (Input) 8
- 3-pin connector X6
- NO contact 1
- Common 2
- NC contact 3
- USB connector with optional isolator and surge protection
- 5-pin connector X9, X10
- USB speed | JP9, JP10 | Vcc 1
- Data- 2
- High | 1-2
- Data+ 3
- Low | 2-3
- Gnd 4
- Shield 5
- Ethernet and USB PCB connectors
- Note 7.1: Mount X4 and X8 on the opposite (top) side of the PCB. Use 14 mm (e.g. Bossard B3X14/BN3320) for enclosure with 3 mm rear panel
- Licensed under the TAPR Open Hardware License (www.tapr.org/OHL)
- More info at http://www.envox.hr/eez
- Repository: https://github.com/eez-open

## Sheet 8 of 12: Binding posts relays, LED driver
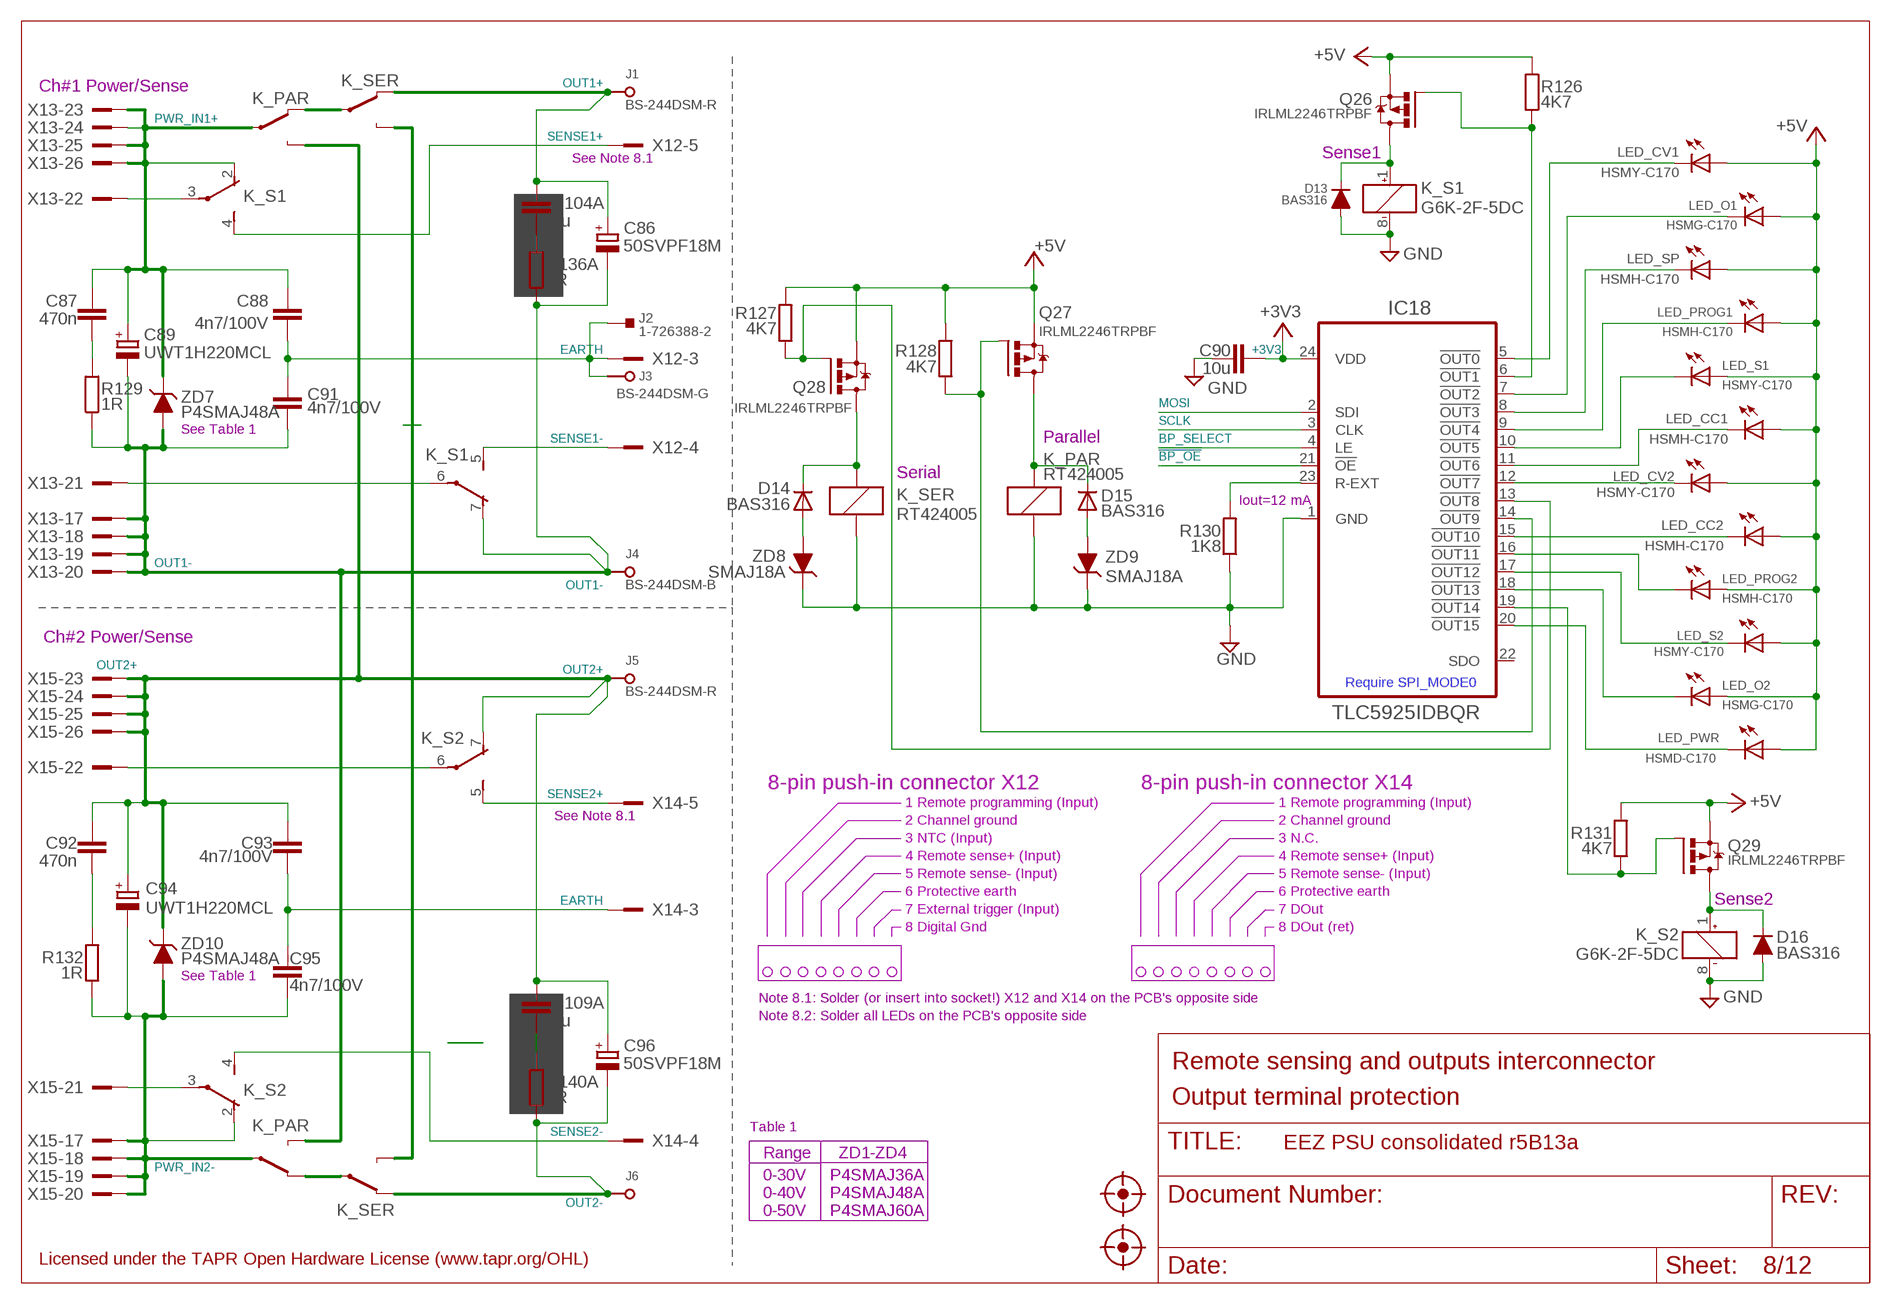
[diagram p7: schematic, sheet 8]

### Parts
C86  50SVPF18M  EEE-FK1J220P-CASE-E  [CAPAE830X650N]
C87  470n  C-EUC0805  [C0805]
C88  4n7/100V  C-EUC1210  [C1210]
C89  UWT1H220MCL  EEE-FK1J220P-CASE-E  [CAPAE830X650N]
C90  10u  C-EUC1210  [C1210]
C91  4n7/100V  C-EUC1210  [C1210]
C92  470n  C-EUC0805  [C0805]
C93  4n7/100V  C-EUC1210  [C1210]
C94  UWT1H220MCL  EEE-FK1J220P-CASE-E  [CAPAE830X650N]
C95  4n7/100V  C-EUC1210  [C1210]
C96  50SVPF18M  EEE-FK1J220P-CASE-E  [CAPAE830X650N]
C104A  1u  C-EUC0805  [C0805]
C109A  1u  C-EUC0805  [C0805]
D13  BAS316  DIODESOD323R  [SOD323-R]
D14  BAS316  DIODE-SOD323-W  [SOD323-W]
D15  BAS316  DIODE-SOD323-W  [SOD323-W]
D16  BAS316  DIODESOD323R  [SOD323-R]
FM5  FIDUCIAL_2  [FIDUCIAL_DUAL]
FM6  FIDUCIAL_2  [FIDUCIAL_DUAL]
IC18  TLC5925IDBQR  [SOP63P600X175-24N]
J1  BS-244DSM-R  BINDING_POST-2  [BP_5_12]
J2  1-726388-2  PCB_TAB4.8MM  [PCB_TAB-4.8MM]
J3  BS-244DSM-G  BINDING_POST-2  [BP_5_12]
J4  BS-244DSM-B  BINDING_POST-2  [BP_5_12]
J5  BS-244DSM-R  BINDING_POST-2  [BP_5_12]
J6  BS-244DSM-B  BINDING_POST-2  [BP_5_12]
K_PAR  RT424005  RELAY_RT314012-2  [RT-C/016A5_ROUND]
K_S1  G6K-2F-5DC  G6K-2F  [G6K-2F]
K_S2  G6K-2F-5DC  G6K-2F  [G6K-2F]
K_SER  RT424005  RELAY_RT314012-2  [RT-C/016A5_ROUND]
LED_CC1  HSMH-C170  LEDHSMH-C170  [LED_HSMH-C170]
LED_CC2  HSMH-C170  LEDHSMH-C170  [LED_HSMH-C170]
LED_CV1  HSMY-C170  LED0805  [LED_0805]
LED_CV2  HSMY-C170  LED0805  [LED_0805]
LED_O1  HSMG-C170  LED0805  [LED_0805]
LED_O2  HSMG-C170  LED0805  [LED_0805]
LED_PROG1  HSMH-C170  LEDHSMH-C170  [LED_HSMH-C170]
LED_PROG2  HSMH-C170  LEDHSMH-C170  [LED_HSMH-C170]
LED_PWR  HSMD-C170  LED0805  [LED_0805]
LED_S1  HSMY-C170  LED0805  [LED_0805]
LED_S2  HSMY-C170  LED0805  [LED_0805]
LED_SP  HSMH-C170  LEDHSMH-C170  [LED_HSMH-C170]
Q26  IRLML2246TRPBF  [SOT95P237X112-3N]
Q27  IRLML2246TRPBF  [SOT95P237X112-3N]
Q28  IRLML2246TRPBF  [SOT95P237X112-3N]
Q29  IRLML2246TRPBF  [SOT95P237X112-3N]
R126  4K7  R-EU_R0805  [R0805]
R127  4K7  R-EU_R0805  [R0805]
R128  4K7  R-EU_R0805  [R0805]
R129  1R  R-EU_R0805  [R0805]
R130  1K8  R-EU_R0805  [R0805]
R131  4K7  R-EU_R0805  [R0805]
R132  1R  R-EU_R0805  [R0805]
R136A  1R  R-EU_R0805  [R0805]
R140A  1R  R-EU_R0805  [R0805]
X12  MC000006  MC000006MIRROR  [MC000006_MIRROR]
X13  TSW-113-07-F-D  [TSW-113-07-F-D]
X14  MC000006  MC000006MIRROR  [MC000006_MIRROR]
X15  TSW-113-07-F-D  [TSW-113-07-F-D]
ZD7  P4SMAJ48A  PSMAXX  [DO214AC]
ZD8  SMAJ18A  PSMAXX  [DO214AC]
ZD9  SMAJ18A  PSMAXX  [DO214AC]
ZD10  P4SMAJ48A  PSMAXX  [DO214AC]

### Nets
!BP_OE: IC18.21(!OE) ; also sheet 9
!BP_OUT0: IC18.5(!OUT0) LED_CV1.C
!BP_OUT1: IC18.6(!OUT1) Q26.1(G) R126.1
!BP_OUT2: IC18.7(!OUT2) LED_O1.C
!BP_OUT3: IC18.8(!OUT3) LED_SP.C
!BP_OUT4: IC18.9(!OUT4) LED_PROG1.C
!BP_OUT5: IC18.10(!OUT5) LED_S1.C
!BP_OUT6: IC18.11(!OUT6) LED_CC1.C
!BP_OUT7: IC18.12(!OUT7) LED_CV2.C
!BP_OUT8: IC18.13(!OUT8) Q28.1(G) R127.1
!BP_OUT9: IC18.14(!OUT9) Q27.1(G) R128.1
!BP_OUT10: IC18.15(!OUT10) LED_CC2.C
!BP_OUT12: IC18.17(!OUT12) LED_S2.C
!BP_OUT13: IC18.18(!OUT13) LED_O2.C
!BP_OUT14: IC18.19(!OUT14) Q29.1(G) R131.1
!BP_OUT15: IC18.20(!OUT15) LED_PWR.C
+3V3: C90.1 IC18.24(VDD) ; also sheet 9,10,11,12
+5V: LED_CC1.A LED_CC2.A LED_CV1.A LED_CV2.A LED_O1.A LED_O2.A LED_PROG1.A LED_PROG2.A LED_PWR.A LED_S1.A LED_S2.A LED_SP.A Q26.2(S) Q27.2(S) Q28.2(S) Q29.2(S) R126.2 R127.2 R128.2 R131.2 ; also sheet 2,3,4,5,6,7,9,10,11
BP_SELECT: IC18.4(LE) ; also sheet 9
EARTH: C88.2 C91.1 C93.2 C95.1 J2.P$1 J2.P$2 J3.P$1 X12.3 X12.3.1 X14.3 X14.3.1 ; also sheet 1,10
GND [gnd]: C90.2 D13.A D16.A IC18.1(GND) K_PAR.A1(K:C2) K_S1.8(1:-) K_S2.8(1:-) K_SER.A1(K:C2) R130.1 ZD8.C ZD9.C ; also sheet 1,2,3,4,5,6,7,9,10,11,12
MOSI: IC18.2(SDI) ; also sheet 9,10,12
N$92: D13.C K_S1.1(1:+) Q26.3(D)
N$93: D16.C K_S2.1(1:+) Q29.3(D)
N$94: C87.2 R129.2
N$95: C92.2 R132.2
N$96: IC18.16(!OUT11) LED_PROG2.C
N$97: K_SER.14A(-1:O) K_SER.14B(-2:O)
N$98: K_PAR.12A(-1:S) K_SER.11B(-2:P)
N$99: K_PAR.12B(-2:S) K_SER.11A(-1:P)
N$128: D14.A ZD8.A
N$131 [gnd]: D15.A ZD9.A
N$155: D14.C K_SER.A2(K:C1) Q28.3(D)
N$156: D15.C K_PAR.A2(K:C1) Q27.3(D)
N$176: C104A.2 R136A.2
N$178: C109A.2 R140A.2
N$306: IC18.23(R-EXT) R130.2
OUT1+: C86.1 C104A.1 J1.P$1 K_SER.12B(-2:S)
OUT1-: C86.2 C89.2 C91.2 J4.P$1 K_PAR.14B(-2:O) K_S1.7(3:O) R129.1 R136A.1 X13.17 X13.18 X13.19 X13.20 ZD7.A
OUT2+: C92.1 C93.1 C94.1 C96.1 C109A.1 J5.P$1 K_PAR.14A(-1:O) K_S2.7(3:O) X15.23 X15.24 X15.25 X15.26 ZD10.C
OUT2-: C96.2 J6.P$1 K_SER.12A(-1:S) R140A.1
PWR_IN1+: C87.1 C88.1 C89.1 K_PAR.11A(-1:P) K_S1.2(2:O) X13.23 X13.24 X13.25 X13.26 ZD7.C
PWR_IN2-: C94.2 C95.2 K_PAR.11B(-2:P) K_S2.2(2:O) R132.1 X15.17 X15.18 X15.19 X15.20 ZD10.A
SCLK: IC18.3(CLK) ; also sheet 9,10,12
SENSE1+: K_S1.4(2:S) X12.5 X12.5.1
SENSE1-: K_S1.5(3:S) X12.4 X12.4.1
SENSE1_IN+: K_S1.3(2:P) X13.22
SENSE1_IN-: K_S1.6(3:P) X13.21
SENSE2+: K_S2.5(3:S) X14.5 X14.5.1
SENSE2-: K_S2.4(2:S) X14.4 X14.4.1
SENSE2_IN+: K_S2.6(3:P) X15.22
SENSE2_IN-: K_S2.3(2:P) X15.21
Unconnected: IC18.22(SDO) X14.6 X14.6.1

### Notes on the sheet
- Ch#1 Power/Sense
- Sense1
- See Note 8.1
- See Table 1
- Parallel
- Serial
- Iout=12 mA
- Ch#2 Power/Sense
- Require SPI_MODE0
- 8-pin push-in connector X12 | 8-pin push-in connector X14
- 1 Remote programming (Input) | 1 Remote programming (Input)
- See Note 8.1
- 2 Channel ground | 2 Channel ground
- 3 NTC (Input) | 3 N.C.
- 4 Remote sense+ (Input) | 4 Remote sense+ (Input)
- 5 Remote sense- (Input) | 5 Remote sense- (Input)
- 6 Protective earth | 6 Protective earth
- Sense2
- 7 External trigger (Input) | 7 DOut
- 8 Digital Gnd | 8 DOut (ret)
- See Table 1
- Note 8.1: Solder (or insert into socket!) X12 and X14 on the PCB's opposite side
- Note 8.2: Solder all LEDs on the PCB's opposite side
- Remote sensing and outputs interconnector
- Output terminal protection
- Table 1
- Range | ZD1-ZD4
- 0-30V | P4SMAJ36A
- 0-40V | P4SMAJ48A
- 0-50V | P4SMAJ60A
- Licensed under the TAPR Open Hardware License (www.tapr.org/OHL)

## Sheet 9 of 12: Isolators, Arduino
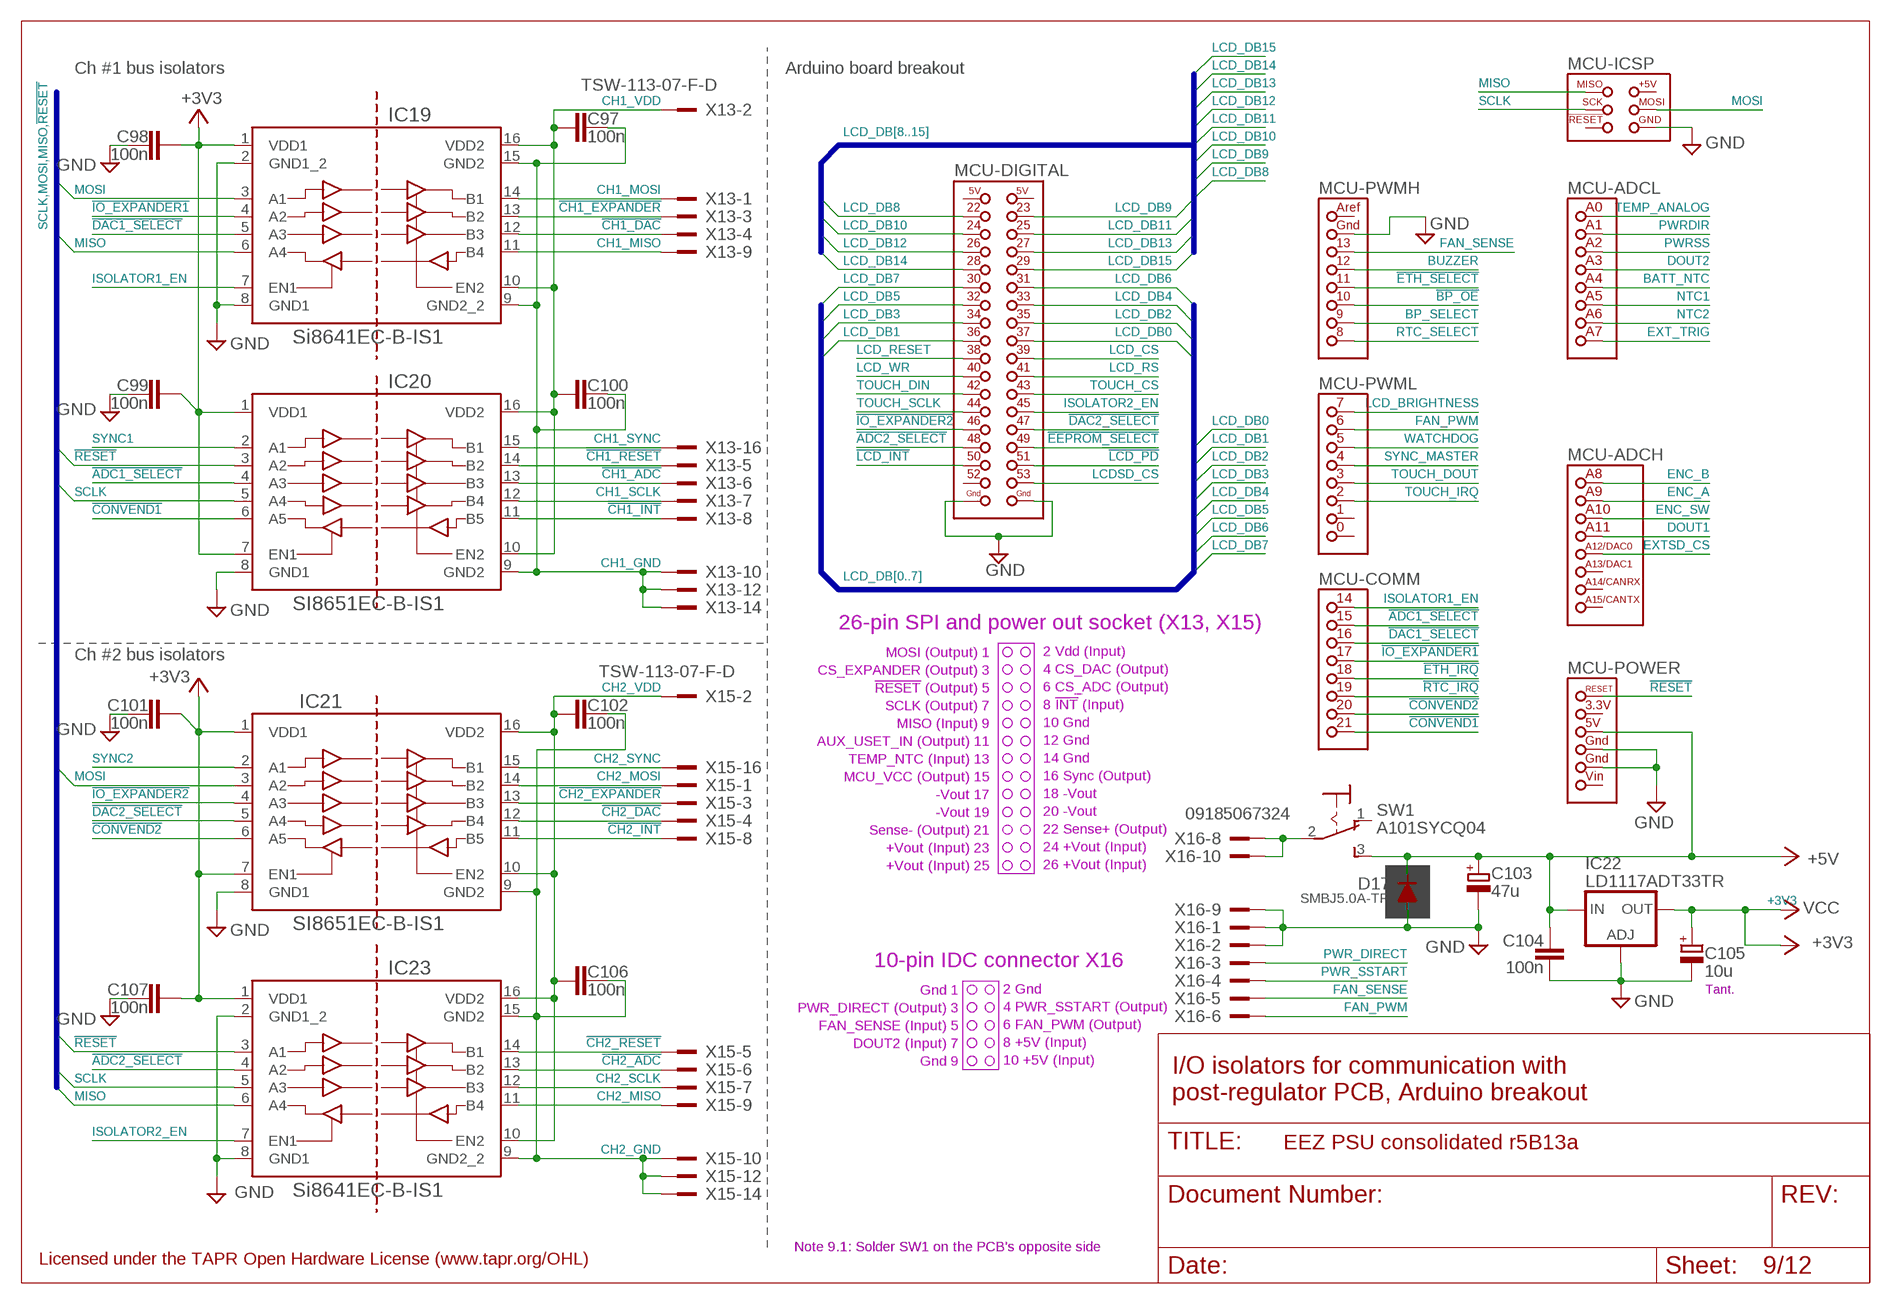
[diagram p8: schematic, sheet 9]

### Parts
C97  100n  C-EUC0603  [C0603]
C98  100n  C-EUC0603  [C0603]
C99  100n  C-EUC0603  [C0603]
C100  100n  C-EUC0603  [C0603]
C101  100n  C-EUC0603  [C0603]
C102  100n  C-EUC0603  [C0603]
C103  47u  ECAPPANASONIC_H  [CAPAE660X610N]
C104  100n  C-EUC0603  [C0603]
C105  10u  ECAP1206  [EC1206]
C106  100n  C-EUC0603  [C0603]
C107  100n  C-EUC0603  [C0603]
D17  SMBJ5.0A-TR  DIODEDO214AA  [DO214AA]
IC19  Si8641EC-B-IS1  SI8641NSOIC-16  [SOIC-16]
IC20  SI8651EC-B-IS1  SI8651NSOIC-16  [SOIC-16]
IC21  SI8651EC-B-IS1  SI8651NSOIC-16  [SOIC-16]
IC22  LD1117ADT33TR  LD117AS33TR  [SOT223]
IC23  Si8641EC-B-IS1  SI8641NSOIC-16  [SOIC-16]
MCU  Arduino Due  ARDUINO_MEGA+ICSPMIRROR  [ARDUINO+ICSP_MIRROR]
SW1  A101SYCQ04  M9040P  [M9040P]
X16  09185067324  IDC-10PINBLACK  [IDC-10PIN]

### Nets
!ADC1_SELECT: IC20.4(A3) MCU.15
!ADC2_SELECT: IC23.4(A2) MCU.48(-DIGITAL:48(PL3))
!BP_OE: MCU.10 ; also sheet 8
!CH1_ADC: IC20.13(B3) X13.6
!CH1_DAC: IC19.12(B3) X13.4
!CH1_EXPANDER: IC19.13(B2) X13.3
!CH1_INT: IC20.11(B5) X13.8
!CH1_RESET: IC20.14(B2) X13.5
!CH2_ADC: IC23.13(B2) X15.6
!CH2_DAC: IC21.12(B4) X15.4
!CH2_EXPANDER: IC21.13(B3) X15.3
!CH2_INT: IC21.11(B5) X15.8
!CH2_RESET: IC23.14(B1) X15.5
!CONVEND1: IC20.6(A5) MCU.21
!CONVEND2: IC21.6(A5) MCU.20
!DAC1_SELECT: IC19.5(A3) MCU.16
!DAC2_SELECT: IC21.5(A4) MCU.47(-DIGITAL:47(PL4))
!EEPROM_SELECT: MCU.49(-DIGITAL:49(PL2)) ; also sheet 10
!ETH_IRQ: MCU.18 ; also sheet 10
!ETH_SELECT: MCU.11 ; also sheet 10
!IO_EXPANDER1: IC19.4(A2) MCU.17
!IO_EXPANDER2: IC21.4(A3) MCU.46(-DIGITAL:46(PL5))
!LCD_INT: MCU.50(-DIGITAL:50(PL1/MISO)) ; also sheet 12
!LCD_PD: MCU.51(-DIGITAL:51(PL0)) ; also sheet 12
!RESET: IC20.3(A2) IC23.3(A1) MCU.RESET(-POWER:!RESET) ; also sheet 10,11
!RTC_IRQ: MCU.19 ; also sheet 10
+3V3: C98.1 C99.1 C101.1 C105.+ C107.1 IC19.1(VDD1) IC20.1(VDD1) IC20.7(EN1) IC21.1(VDD1) IC21.7(EN1) IC22.4(OUT) IC23.1(VDD1) ; supply symbol labelled VCC ; also sheet 8,10,11,12
+5V: C103.1(+) C104.1 D17.C IC22.3(IN) MCU.5V(-POWER:5V) SW1.3(S) ; also sheet 2,3,4,5,6,7,8,10,11
BATT_NTC: MCU.A4(-ADCL:ADC4) ; also sheet 11
BP_SELECT: MCU.9(-PWMH:9(PH6)) ; also sheet 8
BUZZER: MCU.12 ; also sheet 10
CH1_GND: C97.2 C100.2 IC19.9(GND2_2) IC19.15(GND2) IC20.9(GND2) X13.10 X13.12 X13.14 ; also sheet 11
CH1_MISO: IC19.11(B4) X13.9
CH1_MOSI: IC19.14(B1) X13.1
CH1_SCLK: IC20.12(B4) X13.7
CH1_SYNC: IC20.15(B1) X13.16
CH1_VDD: C97.1 C100.1 IC19.10(EN2) IC19.16(VDD2) IC20.10(EN2) IC20.16(VDD2) X13.2 ; also sheet 11
CH2_GND: C102.2 C106.2 IC21.9(GND2) IC23.9(GND2_2) IC23.15(GND2) X15.10 X15.12 X15.14 ; also sheet 11
CH2_MISO: IC23.11(B4) X15.9
CH2_MOSI: IC21.14(B2) X15.1
CH2_SCLK: IC23.12(B3) X15.7
CH2_SYNC: IC21.15(B1) X15.16
CH2_VDD: C102.1 C106.1 IC21.10(EN2) IC21.16(VDD2) IC23.10(EN2) IC23.16(VDD2) X15.2
DOUT1: MCU.A11(-ADCH:ADC11) ; also sheet 11
DOUT2: MCU.A3(-ADCL:ADC3) ; also sheet 11
ENC_A: MCU.A9(-ADCH:ADC9) ; also sheet 11
ENC_B: MCU.A8(-ADCH:ADC8) ; also sheet 11
ENC_SW: MCU.A10(-ADCH:ADC10) ; also sheet 11
EXT_TRIG: MCU.A7(-ADCL:ADC7) ; also sheet 11
EXTSD_CS: MCU.A12(-ADCH:ADC12) ; also sheet 12
FAN_PWM: MCU.6(-PWML:6(PH3)) X16.6
FAN_SENSE: MCU.13 X16.5
GND [gnd]: C98.2 C99.2 C101.2 C103.2(-) C104.2 C105.- C107.2 D17.A IC19.2(GND1_2) IC19.8(GND1) IC20.8(GND1) IC21.8(GND1) IC22.1(ADJ) IC23.2(GND1_2) IC23.8(GND1) MCU.GND1(-POWER:GND1) MCU.GND2(-POWER:GND2) MCU.GND3(-DIGITAL:GND3) MCU.GND4(-DIGITAL:GND4) MCU.GND(-PWMH:GND) MCU.ICSP_GND(-ICSP:GND) X16.1 X16.2 X16.9 ; also sheet 1,2,3,4,5,6,7,8,10,11,12
ISOLATOR1_EN: IC19.7(EN1) MCU.14
ISOLATOR2_EN: IC23.7(EN1) MCU.45(-DIGITAL:45(PL6))
LCD_BRIGHTNESS: MCU.7(-PWML:7(PH4)) ; also sheet 10
LCD_CS: MCU.39(-DIGITAL:39(PC0)) ; also sheet 10,12
LCD_DB0: MCU.37(-DIGITAL:37(PC2)) ; also sheet 10
LCD_DB1: MCU.36(-DIGITAL:36(PC3)) ; also sheet 10
LCD_DB2: MCU.35(-DIGITAL:35(PC4)) ; also sheet 10
LCD_DB3: MCU.34(-DIGITAL:34(PC5)) ; also sheet 10
LCD_DB4: MCU.33(-DIGITAL:33(PC6)) ; also sheet 10
LCD_DB5: MCU.32(-DIGITAL:32(PC7)) ; also sheet 10
LCD_DB6: MCU.31(-DIGITAL:31(PA7)) ; also sheet 10
LCD_DB7: MCU.30(-DIGITAL:30(PA6)) ; also sheet 10
LCD_DB8: MCU.22 ; also sheet 10
LCD_DB9: MCU.23 ; also sheet 10
LCD_DB10: MCU.24(-DIGITAL:24(PA0)) ; also sheet 10
LCD_DB11: MCU.25(-DIGITAL:25(PA1)) ; also sheet 10
LCD_DB12: MCU.26(-DIGITAL:26(PA2)) ; also sheet 10
LCD_DB13: MCU.27(-DIGITAL:27(PA3)) ; also sheet 10
LCD_DB14: MCU.28(-DIGITAL:28(PA4)) ; also sheet 10
LCD_DB15: MCU.29(-DIGITAL:29(PA5)) ; also sheet 10
LCD_RESET: MCU.38(-DIGITAL:38(PC1)) ; also sheet 10
LCD_RS: MCU.41(-DIGITAL:41(PG2)) ; also sheet 10
LCD_WR: MCU.40(-DIGITAL:40(PD7)) ; also sheet 10
LCDSD_CS: MCU.53(-DIGITAL:53(PB2/MOSI)) ; also sheet 10,12
MISO: IC19.6(A4) IC23.6(A4) MCU.ICSP_MISO(-ICSP:MISO) ; also sheet 10,12
MOSI: IC19.3(A1) IC21.3(A2) MCU.ICSP_MOSI(-ICSP:MOSI) ; also sheet 8,10,12
N$100: SW1.2(P) X16.8 X16.10
NTC1: MCU.A5(-ADCL:ADC5) ; also sheet 10
NTC2: MCU.A6(-ADCL:ADC6) ; also sheet 10
PWR_DIRECT: X16.3 ; also sheet 11
PWR_SSTART: X16.4 ; also sheet 11
PWRDIR: MCU.A1(-ADCL:ADC1) ; also sheet 11
PWRSS: MCU.A2(-ADCL:ADC2) ; also sheet 11
RTC_SELECT: MCU.8(-PWMH:8(PH5)) ; also sheet 10
SCLK: IC20.5(A4) IC23.5(A3) MCU.ICSP_SCK(-ICSP:SCK) ; also sheet 8,10,12
SYNC1: IC20.2(A1) ; also sheet 11
SYNC2: IC21.2(A1) ; also sheet 11
SYNC_MASTER: MCU.4(-PWML:4(PG5)) ; also sheet 11
TEMP_ANALOG: MCU.A0(-ADCL:ADC0) ; also sheet 10
TOUCH_CS: MCU.43(-DIGITAL:43(PG0)) ; also sheet 10,12
TOUCH_DIN: MCU.42(-DIGITAL:42(PG1)) ; also sheet 10
TOUCH_DOUT: MCU.3(-PWML:3(PE5)) ; also sheet 10
TOUCH_IRQ: MCU.2(-PWML:2(PE4)) ; also sheet 10
TOUCH_SCLK: MCU.44(-DIGITAL:44(PL7)) ; also sheet 10
WATCHDOG: MCU.5(-PWML:5(PE3)) ; also sheet 11
Unconnected: MCU.0(-PWML:0(PE0)) MCU.1(-PWML:1(PE1)) MCU.3.3V(-POWER:3V3) MCU.5V(1)(-DIGITAL:5V(1)) MCU.5V(2)(-DIGITAL:5V(2)) MCU.52(-DIGITAL:52(PB3/SCK)) MCU.A13(-ADCH:ADC13) MCU.A14(-ADCH:ADC14) MCU.A15(-ADCH:ADC15) MCU.AREF(-PWMH:AREF) MCU.ICSP_+5V(-ICSP:+5V) MCU.ICSP_RESET(-ICSP:!RESET) MCU.VIN(-POWER:VIN) SW1.1(O)

### Buses
SCLK,MOSI,MISO,!RESET
LCD_DB[8..15]
LCD_DB[0..7]

### Notes on the sheet
- Ch #1 bus isolators | Arduino board breakout
- 26-pin SPI and power out socket (X13, X15)
- MOSI (Output) 1
- 2 Vdd (Input)
- Ch #2 bus isolators
- CS_EXPANDER (Output) 3
- 4 CS_DAC (Output)
- !RESET! (Output) 5
- 6 CS_ADC (Output)
- SCLK (Output) 7
- 8 !INT! (Input)
- MISO (Input) 9
- 10 Gnd
- AUX_USET_IN (Output) 11
- 12 Gnd
- TEMP_NTC (Input) 13
- 14 Gnd
- MCU_VCC (Output) 15
- 16 Sync (Output)
- -Vout 17
- 18 -Vout
- -Vout 19
- 20 -Vout
- Sense- (Output) 21
- 22 Sense+ (Output)
- +Vout (Input) 23
- 24 +Vout (Input)
- +Vout (Input) 25
- 26 +Vout (Input)
- 10-pin IDC connector X16
- Gnd 1
- 2 Gnd | Tant.
- PWR_DIRECT (Output) 3
- 4 PWR_SSTART (Output)
- FAN_SENSE (Input) 5
- 6 FAN_PWM (Output)
- DOUT2 (Input) 7
- 8 +5V (Input)
- Gnd 9
- 10 +5V (Input)
- I/O isolators for communication with
- post-regulator PCB, Arduino breakout
- Note 9.1: Solder SW1 on the PCB's opposite side
- Licensed under the TAPR Open Hardware License (www.tapr.org/OHL)

## Sheet 10 of 12: SPI peripherals, TFT display
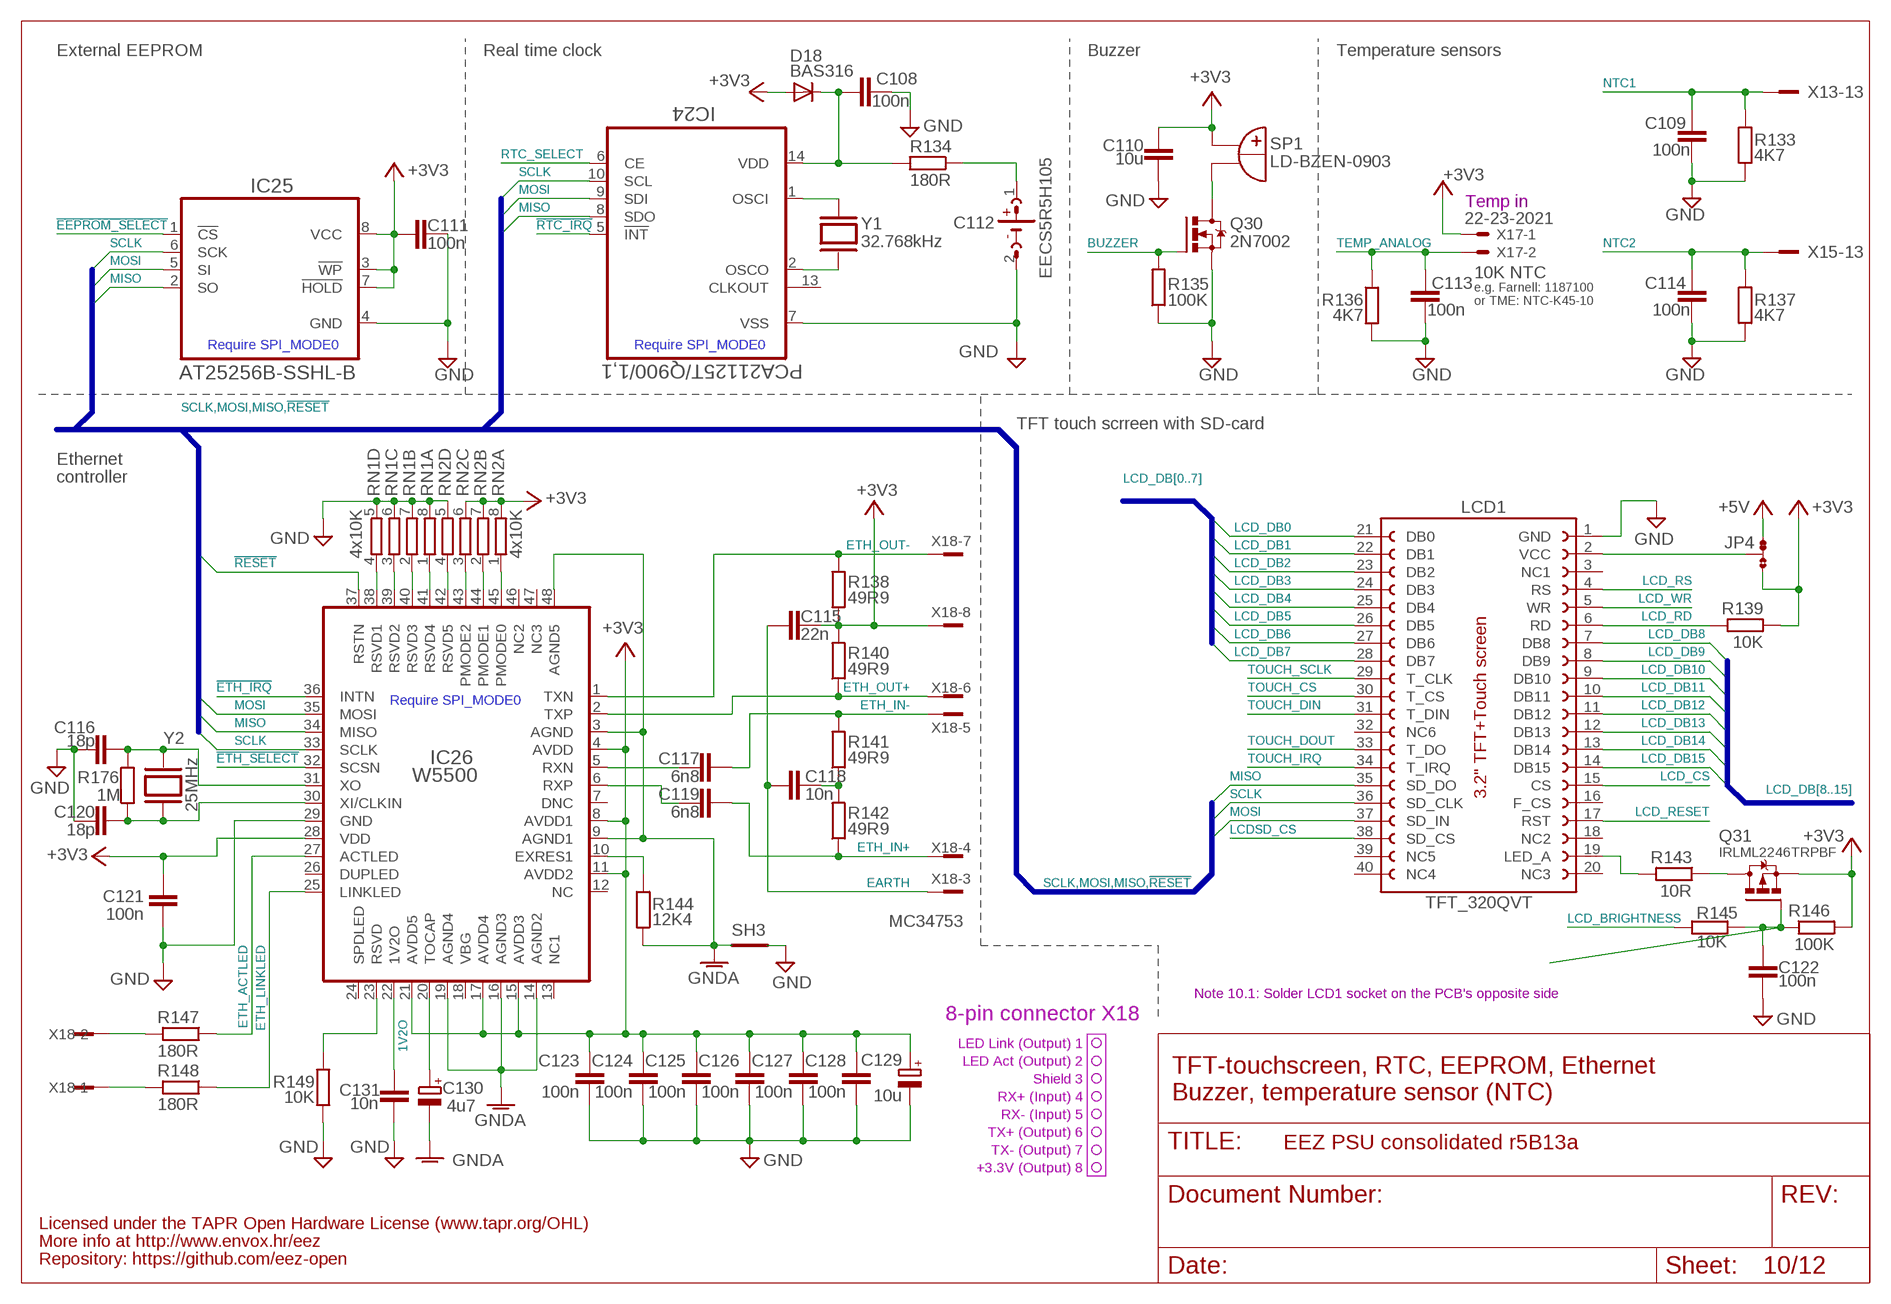
[diagram p9: schematic, sheet 10]

### Parts
C108  100n  C-EUC0603  [C0603]
C109  100n  C-EUC0603  [C0603]
C110  10u  C-EUC1210  [C1210]
C111  100n  C-EUC0603  [C0603]
C112  EECS5R5H105  SUPER_CAP  [SG-R20MM]
C113  100n  C-EUC0603  [C0603]
C114  100n  C-EUC0603  [C0603]
C115  22n  C-EUC0805  [C0805]
C116  18p  C-EUC0805  [C0805]
C117  6n8  C-EUC0603  [C0603]
C118  10n  C-EUC0805  [C0805]
C119  6n8  C-EUC0603  [C0603]
C120  18p  C-EUC0805  [C0805]
C121  100n  C-EUC0603  [C0603]
C122  100n  C-EUC0603  [C0603]
C123  100n  C-EUC0603  [C0603]
C124  100n  C-EUC0603  [C0603]
C125  100n  C-EUC0603  [C0603]
C126  100n  C-EUC0603  [C0603]
C127  100n  C-EUC0603  [C0603]
C128  100n  C-EUC0603  [C0603]
C129  10u  ECAP1206  [EC1206]
C130  4u7  ECAP1206  [EC1206]
C131  10n  C-EUC0805  [C0805]
D18  BAS316  DIODE-SOD323-W  [SOD323-W]
IC24  PCA21125T/Q900/1,1  PCA21125TSSOP-14  [SOP65P640X120-14N]
IC25  AT25256B-SSHL-B  AT25XXXSOIC8  [SOIC127P600X175-8N]
IC26  W5500  [TQFP48-7X7]
JP4  JP3-CUT  [JP3-CUT]
LCD1  TFT_320QVT  LCD_TFT_320QVT9341  [LCD_TFT_9341_MIRROR]
Q30  2N7002  [SOT103P240X110-3N]
Q31  IRLML2246TRPBF  [SOT95P237X112-3N]
R133  4K7  R-EU_R0805  [R0805]
R134  180R  R-EU_R0805  [R0805]
R135  100K  R-EU_R0805  [R0805]
R136  4K7  R-EU_R0805  [R0805]
R137  4K7  R-EU_R0805  [R0805]
R138  49R9  R-EU_R0805  [R0805]
R139  10K  R-EU_R0805  [R0805]
R140  49R9  R-EU_R0805  [R0805]
R141  49R9  R-EU_R0805  [R0805]
R142  49R9  R-EU_R0805  [R0805]
R143  10R  R-EU_R1206  [R1206]
R144  12K4  R-EU_R0805  [R0805]
R145  10K  R-EU_R0805  [R0805]
R146  100K  R-EU_R0805  [R0805]
R147  180R  R-EU_R0805  [R0805]
R148  180R  R-EU_R0805  [R0805]
R149  10K  R-EU_R0805  [R0805]
R176  1M  R-EU_R0805  [R0805]
RN1  4x10K  R_ARRAY4  [CAY16]
RN2  4x10K  R_ARRAY4  [CAY16]
SH3  SHORTNOHOLE  [SHORT_NOHOLE]
SP1  LD-BZEN-0903  BUZZER-2  [LD-BZEN-0903]
X17  22-23-2021  [22-23-2021]
X18  MC34753  HEADER_8-PIN  [HEADER_8-PIN]
Y1  32.768kHz  XTALR26  [R26_XTAL]
Y2  25MHz  XTALSMD  [HC-49/4H]

### Nets
1V2O: C131.2 IC26.22(1V2O)
!EEPROM_SELECT: IC25.1(!CS) ; also sheet 9
!ETH_IRQ: IC26.36(INTN) ; also sheet 9
!ETH_SELECT: IC26.32(SCSN) ; also sheet 9
!RESET: IC26.37(RSTN) ; also sheet 9,11
!RTC_IRQ: IC24.5(!INT) ; also sheet 9
+3V3: C110.2 C111.1 C115.1 C121.2 C123.1 C124.1 C125.1 C126.1 C127.1 C128.1 C129.+ D18.A IC25.3(!WP) IC25.7(!HOLD) IC25.8(VCC) IC26.4(AVDD) IC26.8(AVDD1) IC26.11(AVDD2) IC26.15(AVDD3) IC26.17(AVDD4) IC26.21(AVDD5) IC26.28(VDD) JP4.NO Q31.2(S) R138.1 R139.2 R140.2 R146.2 RN2.6 RN2.7 RN2.8 SP1.+B(+) X17.1 X18.8 ; also sheet 8,9,11,12
+5V: JP4.NC ; also sheet 2,3,4,5,6,7,8,9,11
BUZZER: Q30.1(G) R135.2 ; also sheet 9
EARTH: C115.2 C118.2 X18.3 ; also sheet 1,8
ETH_ACTLED: IC26.27(ACTLED) R147.1
ETH_IN+: C119.1 R142.1 X18.4
ETH_IN-: C117.1 R141.2 X18.5
ETH_LINKLED: IC26.25(LINKLED) R148.1
ETH_OUT+: IC26.2(TXP) R140.1 X18.6
ETH_OUT-: IC26.1(TXN) R138.2 X18.7
GND [gnd]: C108.1 C109.1 C110.1 C111.2 C112.2(-) C113.1 C114.1 C116.2 C120.2 C121.1 C122.1 C123.2 C124.2 C125.2 C126.2 C127.2 C128.2 C129.- C131.1 IC24.7(VSS) IC25.4(GND) IC26.29(GND) LCD1.1(GND) Q30.2(S) R133.2 R135.1 R136.2 R137.2 R149.1 RN1.5 RN1.6 RN1.7 RN1.8 RN2.5 SH3.P$1(GND_A) ; also sheet 1,2,3,4,5,6,7,8,9,11,12
GNDA [gnd]: C130.- IC26.3(AGND) IC26.9(AGND1) IC26.14(AGND2) IC26.16(AGND3) IC26.19(AGND4) IC26.48(AGND5) R144.1 SH3.P$2(GND_B)
LCD_BRIGHTNESS: R145.1 ; also sheet 9
LCD_CS: LCD1.15(CS) ; also sheet 9,12
LCD_DB0: LCD1.21(DB0) ; also sheet 9
LCD_DB1: LCD1.22(DB1) ; also sheet 9
LCD_DB2: LCD1.23(DB2) ; also sheet 9
LCD_DB3: LCD1.24(DB3) ; also sheet 9
LCD_DB4: LCD1.25(DB4) ; also sheet 9
LCD_DB5: LCD1.26(DB5) ; also sheet 9
LCD_DB6: LCD1.27(DB6) ; also sheet 9
LCD_DB7: LCD1.28(DB7) ; also sheet 9
LCD_DB8: LCD1.7(DB8) ; also sheet 9
LCD_DB9: LCD1.8(DB9) ; also sheet 9
LCD_DB10: LCD1.9(DB10) ; also sheet 9
LCD_DB11: LCD1.10(DB11) ; also sheet 9
LCD_DB12: LCD1.11(DB12) ; also sheet 9
LCD_DB13: LCD1.12(DB13) ; also sheet 9
LCD_DB14: LCD1.13(DB14) ; also sheet 9
LCD_DB15: LCD1.14(DB15) ; also sheet 9
LCD_RD: LCD1.6(RD) R139.1
LCD_RESET: LCD1.17(RST) ; also sheet 9
LCD_RS: LCD1.4(RS) ; also sheet 9
LCD_WR: LCD1.5(WR) ; also sheet 9
LCDSD_CS: LCD1.38(SD_CS) ; also sheet 9,12
LED_A: LCD1.19(LED_A) R143.2
MISO: IC24.8(SDO) IC25.2(SO) IC26.34(MISO) LCD1.35(SD_DO) ; also sheet 9,12
MOSI: IC24.9(SDI) IC25.5(SI) IC26.35(MOSI) LCD1.37(SD_IN) ; also sheet 8,9,12
N$101: Q30.3(D) SP1.-B(-)
N$102: JP4.COM LCD1.2(VCC)
N$103: Q31.3(D) R143.1
N$107: C112.1(+) R134.1
N$108: IC26.23(RSVD) R149.2
N$109: C108.2 D18.C IC24.14(VDD) R134.2
N$110: IC26.10(EXRES1) R144.2
N$111: C116.1 IC26.31(XO) R176.2 Y2.1
N$112: C120.1 IC26.30(XI/CLKIN) R176.1 Y2.2
N$113: C117.2 IC26.5(RXN)
N$115: C119.2 IC26.6(RXP)
N$116: R148.2 X18.1
N$118: R147.2 X18.2
N$119: IC26.43(PMODE2) RN2.3
N$120: IC26.44(PMODE1) RN2.2
N$121: IC26.45(PMODE0) RN2.1
N$122: IC26.42(RSVD5) RN2.4
N$123: IC26.38(RSVD1) RN1.4
N$124: C118.1 R141.1 R142.2
N$126: IC26.39(RSVD2) RN1.3
N$127: IC26.41(RSVD4) RN1.1
N$130: IC26.40(RSVD3) RN1.2
N$132: C122.2 Q31.1(G) R145.2 R146.1
N$133: IC24.1(OSCI) Y1.2
N$134: IC24.2(OSCO) Y1.1
NTC1: C109.2 R133.1 X13.13 ; also sheet 9
NTC2: C114.2 R137.1 X15.13 ; also sheet 9
RTC_SELECT: IC24.6(CE) ; also sheet 9
SCLK: IC24.10(SCL) IC25.6(SCK) IC26.33(SCLK) LCD1.36(SD_CLK) ; also sheet 8,9,12
TEMP_ANALOG: C113.2 R136.1 X17.2 ; also sheet 9
TOCAP: C130.+ IC26.20(TOCAP)
TOUCH_CS: LCD1.30(T_CS) ; also sheet 9,12
TOUCH_DIN: LCD1.31(T_DIN) ; also sheet 9
TOUCH_DOUT: LCD1.33(T_DO) ; also sheet 9
TOUCH_IRQ: LCD1.34(T_IRQ) ; also sheet 9
TOUCH_SCLK: LCD1.29(T_CLK) ; also sheet 9
Unconnected: IC24.13(CLKOUT) IC26.7(DNC) IC26.12(NC) IC26.13(NC1) IC26.18(VBG) IC26.24(SPDLED) IC26.26(DUPLED) IC26.46(NC2) IC26.47(NC3) LCD1.3(NC1) LCD1.16(F_CS) LCD1.18(NC2) LCD1.20(NC3) LCD1.32(NC6) LCD1.39(NC5) LCD1.40(NC4)

### Buses
SCLK,MOSI,MISO,!RESET
LCD_DB[0..7]
LCD_DB[8..15]

### Notes on the sheet
- External EEPROM | Real time clock | Buzzer | Temperature sensors
- Temp in
- 10K NTC
- e.g. Farnell: 1187100
- or TME: NTC-K45-10
- Require SPI_MODE0 | Require SPI_MODE0
- TFT touch scrreen with SD-card
- Ethernet
- controller
- Require SPI_MODE0
- Note 10.1: Solder LCD1 socket on the PCB's opposite side
- 8-pin connector X18
- LED Link (Output) 1
- LED Act (Output) 2
- Shield 3 | TFT-touchscreen, RTC, EEPROM, Ethernet
- RX+ (Input) 4
- Buzzer, temperature sensor (NTC)
- RX- (Input) 5
- TX+ (Output) 6
- TX- (Output) 7
- +3.3V (Output) 8
- Licensed under the TAPR Open Hardware License (www.tapr.org/OHL)
- More info at http://www.envox.hr/eez
- Repository: https://github.com/eez-open